# EAGLE board Front_Unit_5.4 (EAGLE 9.6.2), part 1 of 4
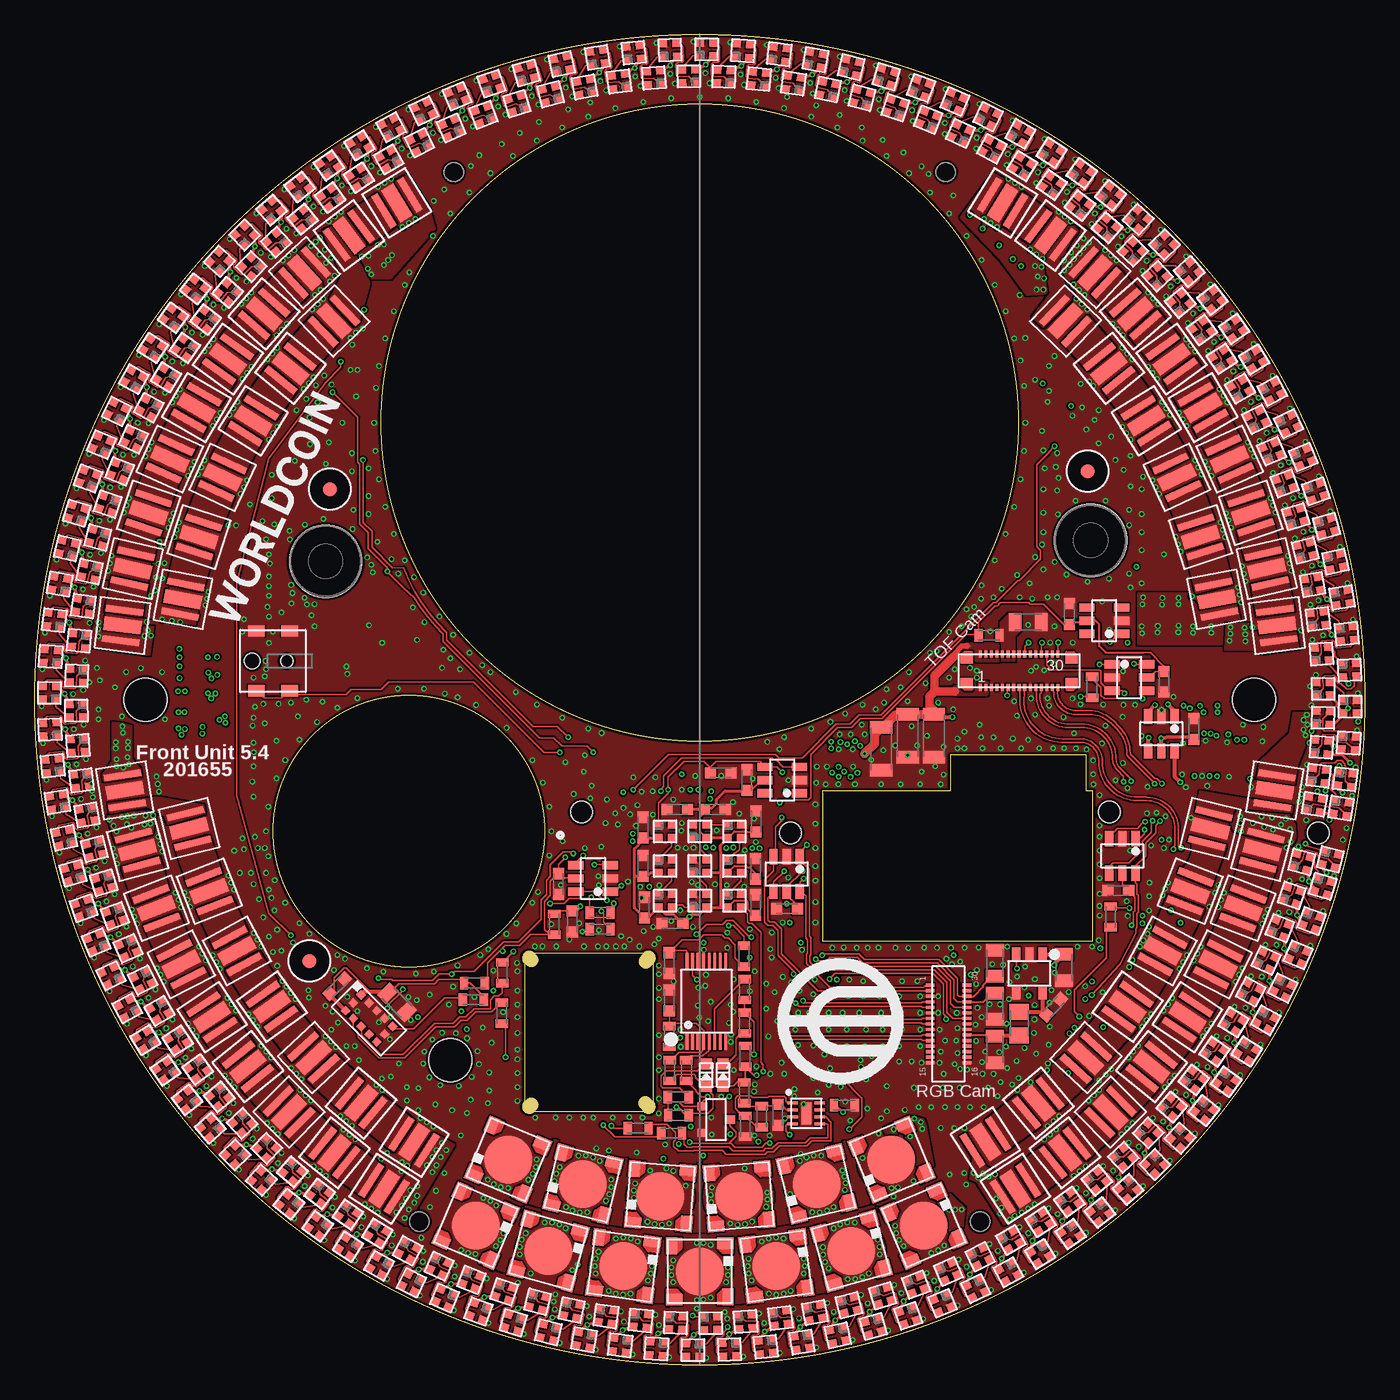
[diagram p9: board, top side]
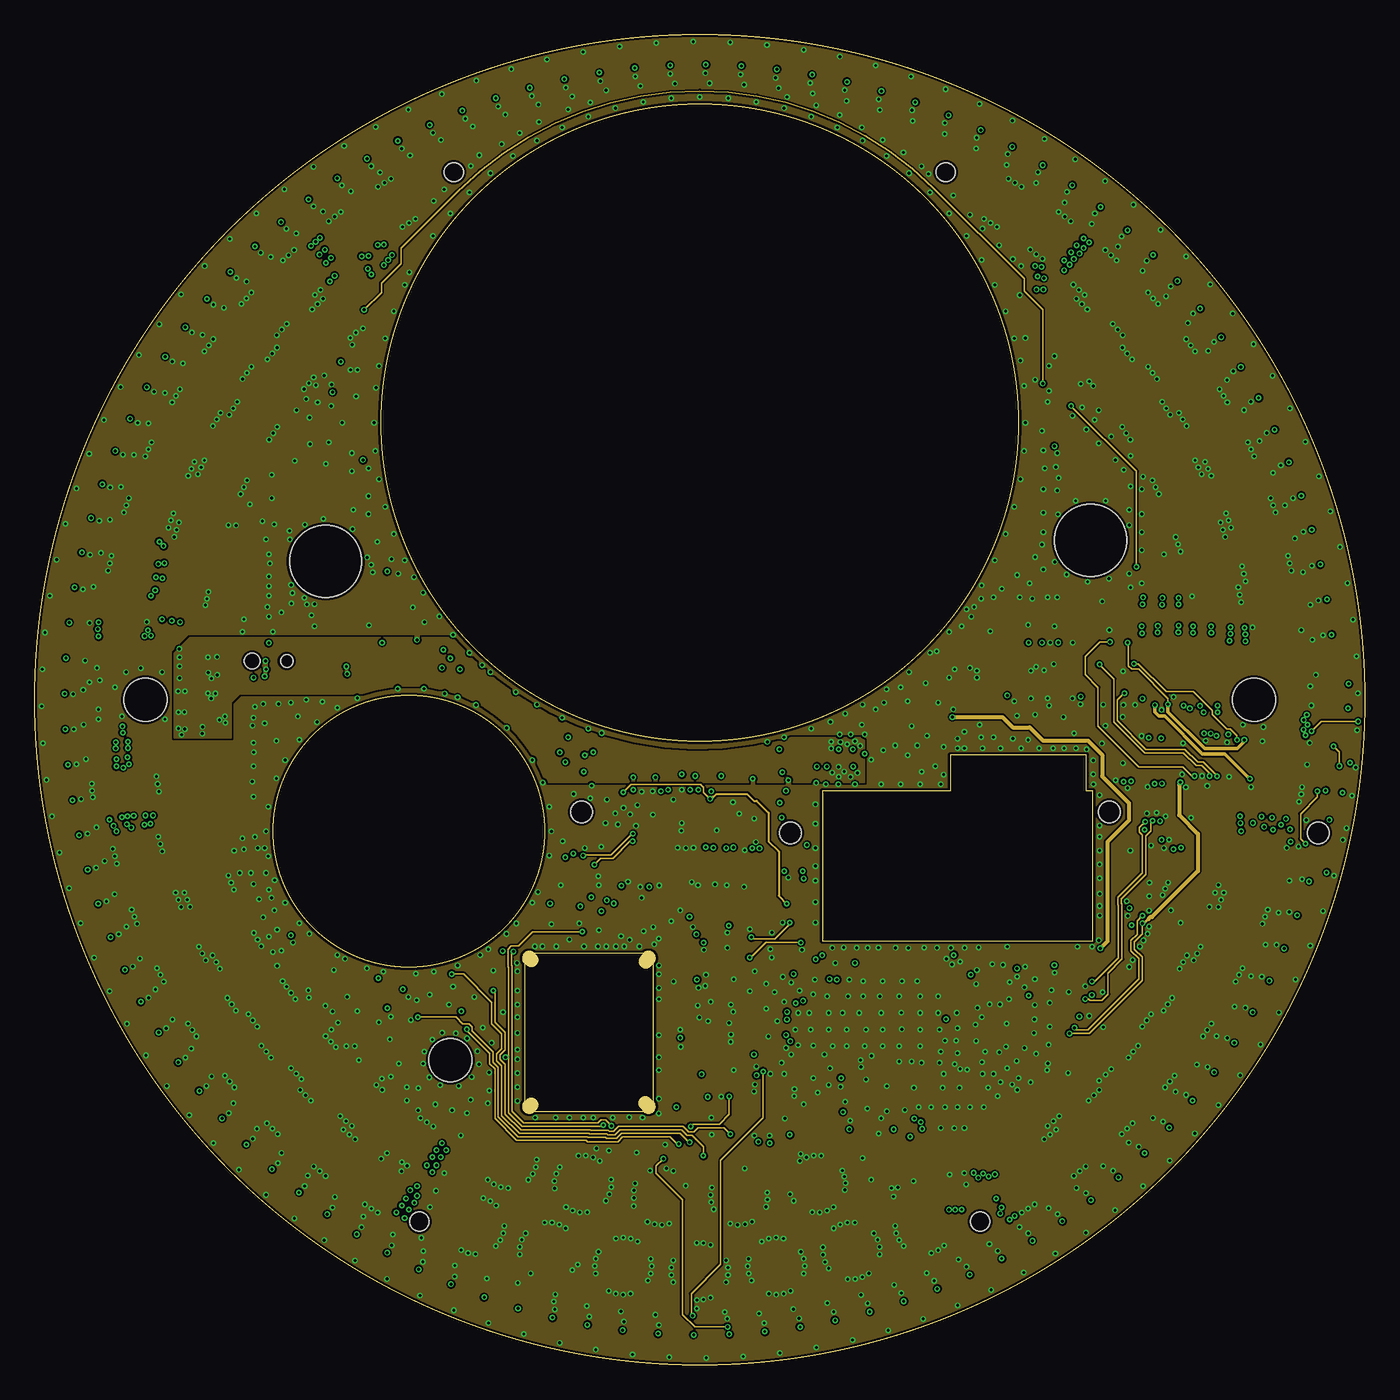
[diagram p10: board, inner layer Route2]
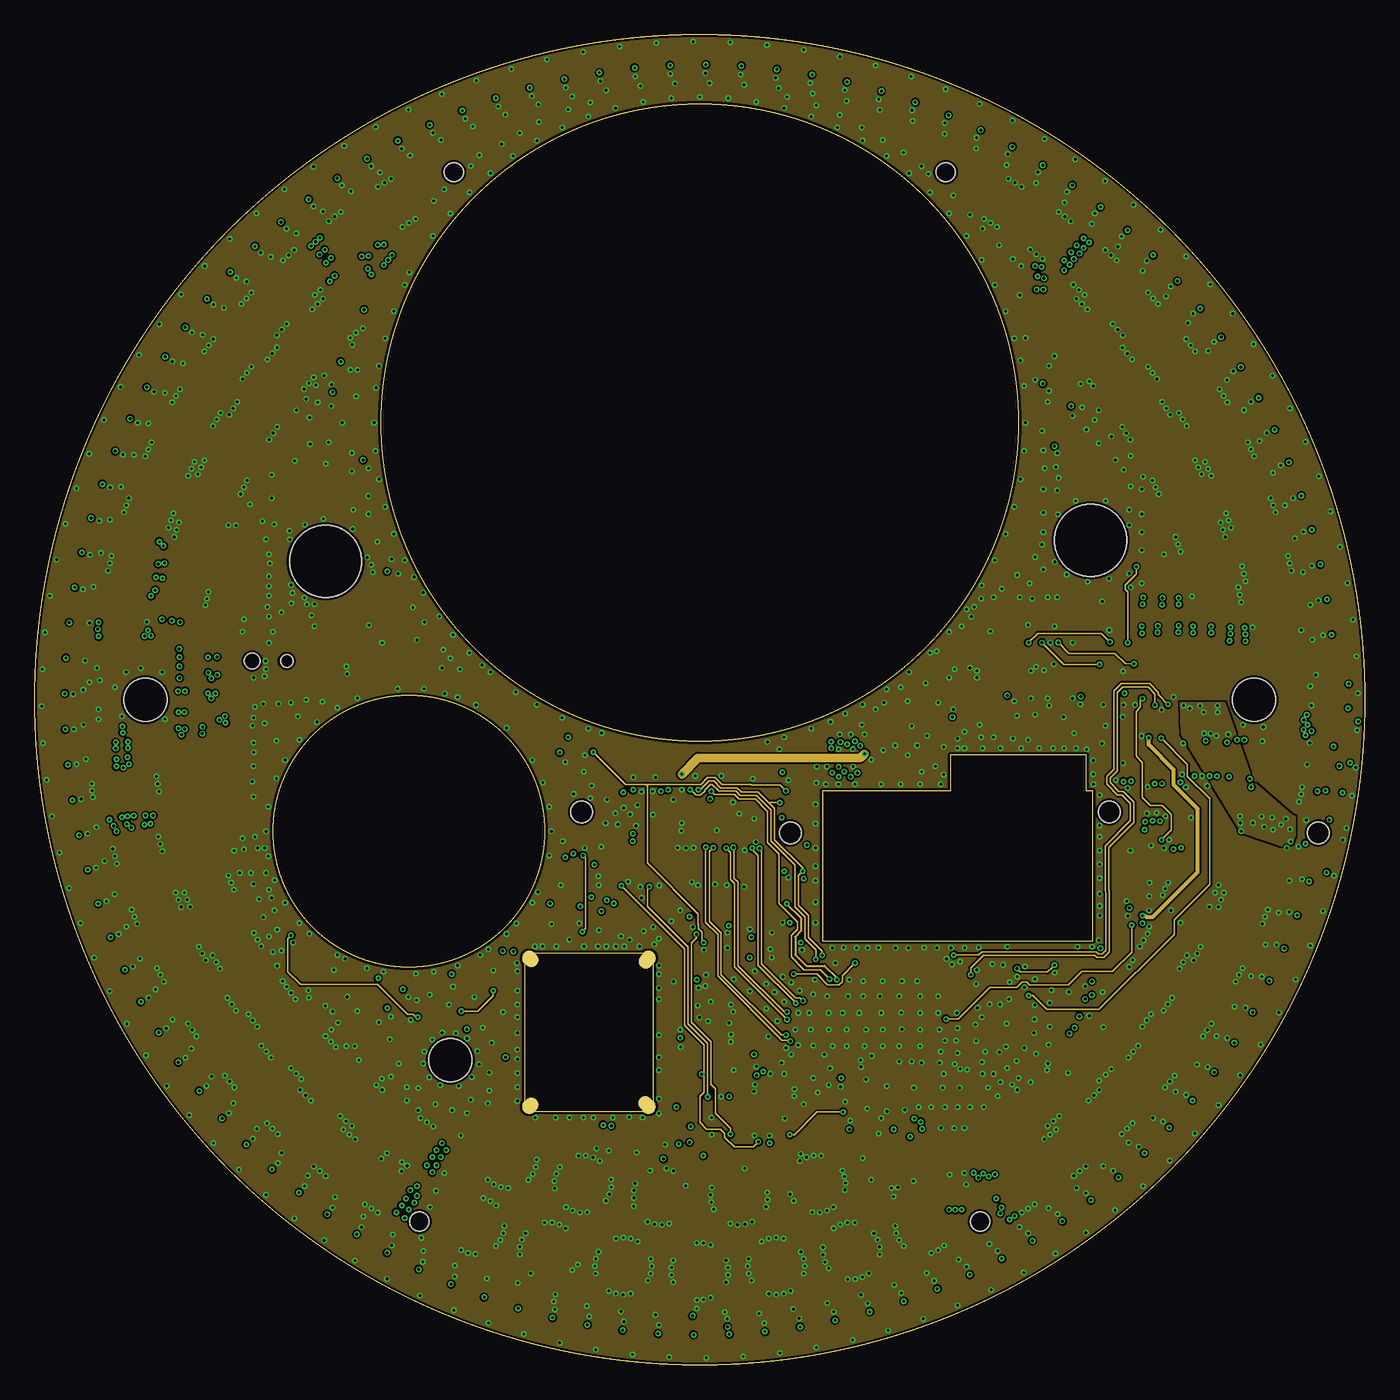
[diagram p11: board, inner layer Route15]
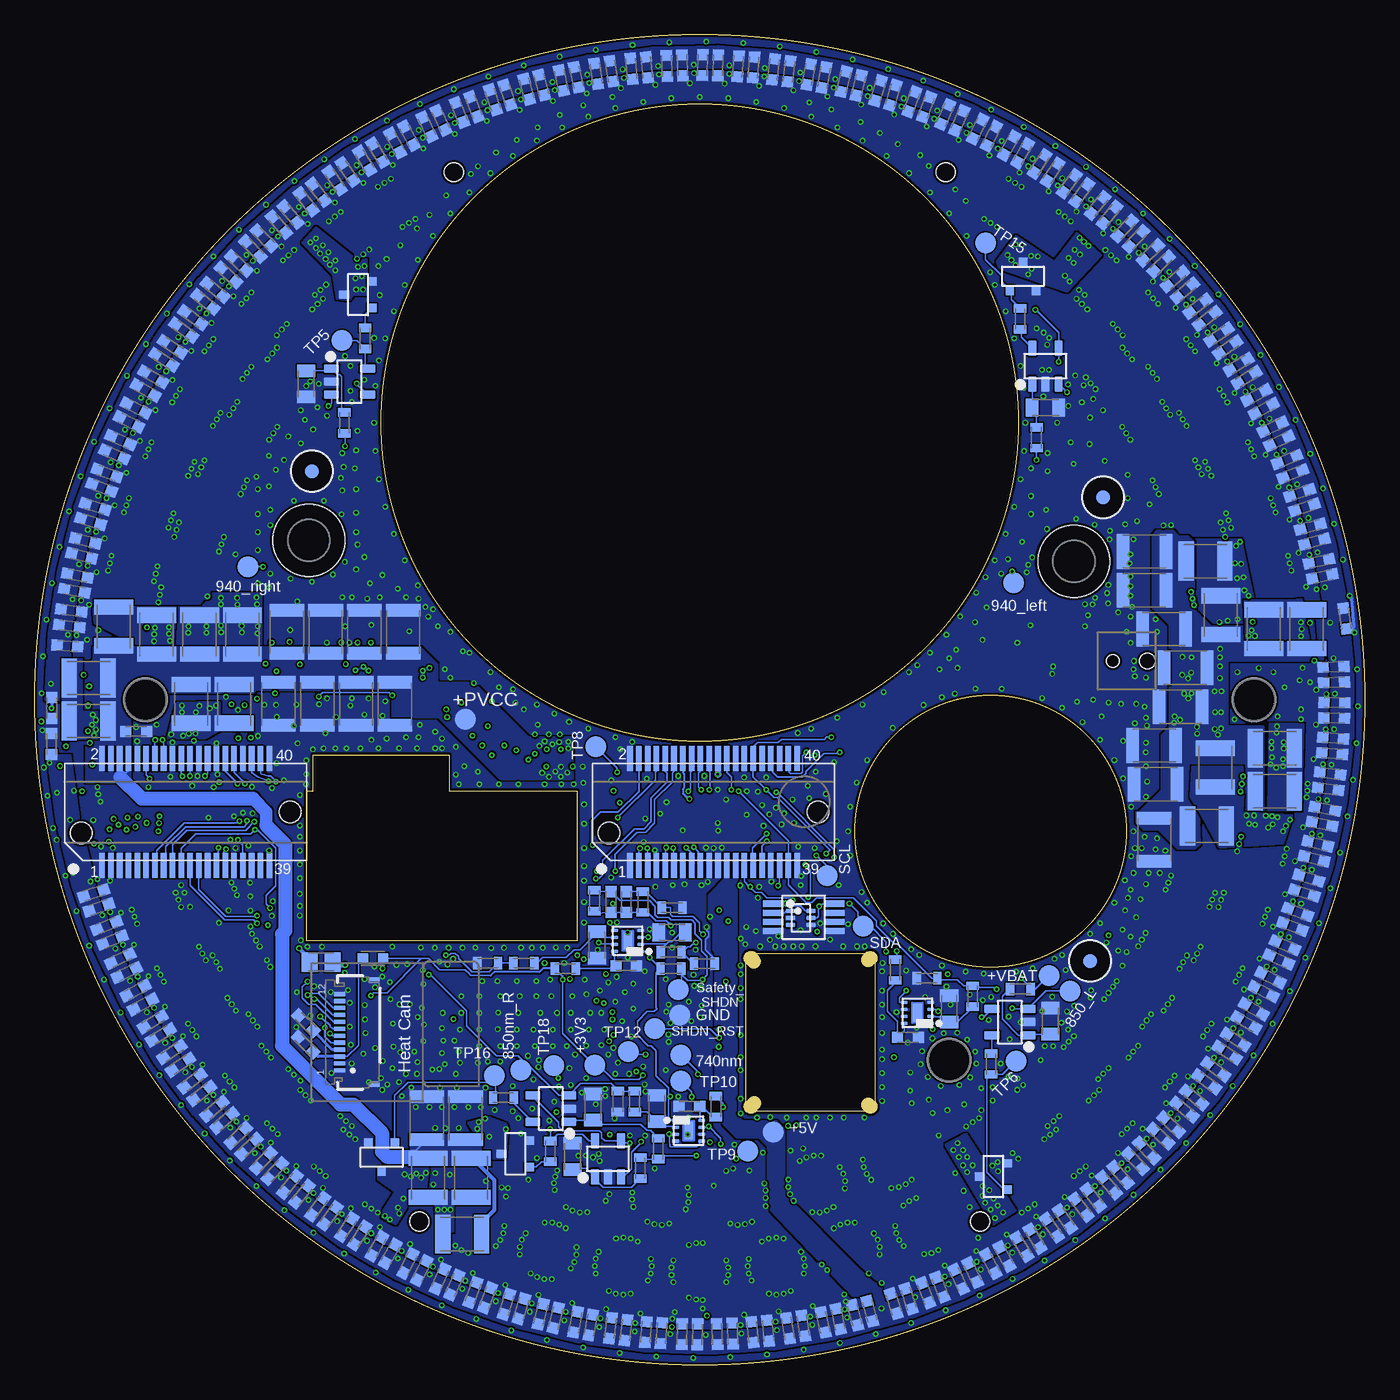
[diagram p12: board, bottom side, seen from below]

Size 96 x 96 mm. Coordinates in mm from the lower left corner, seen from the top.
Outline: 44.65,19 44.65,29 arc180 43.95,29.7 36.05,29.7 arc180 35.35,29 35.35,19 arc180 36.05,18.3 43.95,18.3 arc180 44.65,19
Outline: 75.91,41.4 75.91,44 66.11,44 66.11,41.4 56.85,41.4 56.85,30.6 76.38,30.6 76.38,41.4 75.91,41.4
Outline: circle at 48,68 radius 23
Outline: circle at 27,38.5 radius 9.8
Outline: circle at 48,48 radius 48
Copper layers (1+2*15+16): Top 0.035mm / dielectric 0.14mm / Route2 0.035mm / dielectric 1.2mm / Route15 0.035mm / dielectric 0.14mm / Bottom 0.035mm
Design rules "multi-cb_4L_035um-cu_100um_Strukturen *": minimum track width 0.125mm, minimum drill 0.2mm, track to track 0.125mm, track to pad 0.125mm, pad to pad 0.125mm, via to via 0.125mm, smd to smd 0mil, copper to edge 0.2mm, drill to drill 0.2mm, minimum pad ring 0.1mm, minimum via ring 0.1mm, stop-mask expansion 0.05mm, vias tented up to drill 0.35mm, thermal gap 0.1mm
Net classes: 1 MIPI_diferential_pair: width 0.12 mm, drill 0.2 mm, clearance 0.15 mm to class 0, clearance 0.15 mm
Holes 5.2 mm at 76.2,59.5 21,58
Holes 3.1 mm at 30,22 8,48 88,48
Holes 1.35 mm at 27.77,10.34 68.23,10.34 65.75,86.06 30.25,86.06
tKeepout: area 23.4,43.4 to 72.6,92.6; area 52,19.4 to 60.5,27.9; area 60.5,20.1 to 64,27.1; area 65.3,47.6 to 76.7,52; area 66.5,44 to 75.6,47.6; area 16.2,27.7 to 37.8,49.3; area 27.4,19.4 to 32.5,24.6; 755 lines
bKeepout: area 44.5,20 to 48.5,28; area 48.5,20.1 to 70.5,27.9; area 73.2,56.5 to 79.2,62.5; 1 lines
Milling: 9 lines

## Footprints (pad centres in the part's own frame; a part is rotated, then mirrored left to right if it is on the bottom)
C1210 = smd 0.9 x 2.5: 1 -1.55,0; 2 1.55,0
C0805 = smd 0.9 x 1.3: 1 -0.95,0; 2 0.95,0
C0603 = smd 0.8 x 0.8: 1 -0.75,0; 2 0.75,0
C1206 = smd 0.9 x 1.6: 1 -1.55,0; 2 1.55,0
WL-SMCW_0603_WE = smd 0.8 x 0.8: A -0.8,0; C 0.8,0
LZ1_SMALL_LEDENGIN = smd 0.815 x 1.215: 1 -2.042,1.841; 3 2.042,-1.841 | smd 1.215 x 0.815: 2 1.841,2.042; 4 -1.841,-2.042 | smd 3.45 x 3.45: 5 0,0
B50_LUMINUS = smd 0.5 x 2.7: A -1.1,0; C 1.1,0 | smd 1 x 2.7: NC 0,0
DBV0005A_TI = smd 0.6 x 1.1: 1 -0.95,-1.3; 2 0,-1.3; 3 0.95,-1.3; 4 0.95,1.3; 5 -0.95,1.3
DSG0008A_WSON_TI_NO_VIA = smd 0.5 x 0.25: 1 -0.95,0.75; 2 -0.95,0.25; 3 -0.95,-0.25; 4 -0.95,-0.75; 5 0.95,-0.75; 6 0.95,-0.25; 7 0.95,0.25; 8 0.95,0.75 | smd 0.635 x 1.27: PAD 0,0
VL53L1X_STM = smd 0.5 x 0.5: 1 1.6,-0.8; 2 0.8,-0.8; 3 0,-0.8; 4 -0.8,-0.8; 5 -1.6,-0.8; 6 -1.6,0; 7 -1.6,0.8; 8 -0.8,0.8; 9 0,0.8; 10 0.8,0.8; 11 1.6,0.8; 12 1.6,0
TVSOP-16_TI = smd 0.2 x 1.2: 1 -1.4,-2.9; 2 -1,-2.9; 3 -0.6,-2.9; 4 -0.2,-2.9; 5 0.2,-2.9; 6 0.6,-2.9; 7 1,-2.9; 8 1.4,-2.9; 9 1.4,2.9; 10 1,2.9; 11 0.6,2.9; 12 0.2,2.9; 13 -0.2,2.9; 14 -0.6,2.9; 15 -1,2.9; 16 -1.4,2.9
SOT23-6L_WE = smd 0.6 x 1.1: 1 -0.95,-1.25; 2 0,-1.25; 3 0.95,-1.25; 4 0.95,1.25; 5 0,1.25; 6 -0.95,1.25
S-PDSO-G8_DGK_VSSOP_TI = smd 0.45 x 1.45: 1 -0.975,-2.2; 2 -0.325,-2.2; 3 0.325,-2.2; 4 0.975,-2.2; 5 0.975,2.2; 6 0.325,2.2; 7 -0.325,2.2; 8 -0.975,2.2
DRL0006A_TI = smd 0.67 x 0.3: 1 -0.74,0.5; 2 -0.74,0; 3 -0.74,-0.5; 4 0.74,-0.5; 5 0.74,0; 6 0.74,0.5
WSON008X2120_ROHM = smd 0.22 x 0.75: 1 -0.75,-0.975; 2 -0.25,-0.975; 3 0.25,-0.975; 4 0.75,-0.975; 5 0.75,0.975; 6 0.25,0.975; 7 -0.25,0.975; 8 -0.75,0.975 | smd 1.6 x 0.7: PAD 0,0
R-PDSO-G5_DBV_TI = smd 0.6 x 1.05: 1 -0.95,-1.35; 2 0,-1.35; 3 0.95,-1.35; 4 0.95,1.35; 5 -0.95,1.35
SK6805-EC_IPIXEL = smd 0.55 x 0.55: 1 -0.475,0.475; 2 -0.475,-0.475; 3 0.475,-0.475; 4 0.475,0.475
FERRIT_0603_WIDE_BAND_WUERTH = smd 0.75 x 0.7: 1 -0.725,0; 2 0.725,0
FERRIT_0805_WUERTH = smd 1.15 x 1.42: 1 -0.835,0; 2 0.835,0
PASSERMARKE = smd 1 x 1: P$1 0,0
R0603 = smd 0.6 x 0.9: 1 -0.75,0; 2 0.75,0
R1210 = smd 1.1 x 2.8: 1 -1.4,0; 2 1.4,0
ATE-1C_DIPTRONICS = smd 1.2 x 0.8: 1 -1.2,2.15; 2 1.2,2.15; 3 -1.2,-2.15; 4 1.2,-2.15 | hole 1.1: -1.5,0 | hole 0.9: 1,0
SOT-23_NXP = smd 0.6 x 0.7: 1 0.95,1; 2 -0.95,1; 3 0,-1
TESTPAD_ROUND_1.5MM = smd 1.5 x 1.5: TP 0,0
MEC6-120-02 = smd 0.4 x 1.8: 01 -6.032,-3.85; 02 -6.032,3.85; 03 -5.397,-3.85; 04 -5.397,3.85; 05 -4.763,-3.85; 06 -4.763,3.85; 07 -4.128,-3.85; 08 -4.128,3.85; 09 -3.493,-3.85; 10 -3.493,3.85; 11 -2.857,-3.85; 12 -2.857,3.85; 13 -2.223,-3.85; 14 -2.223,3.85; 15 -1.587,-3.85; 16 -1.587,3.85; 17 -0.953,-3.85; 18 -0.953,3.85; 19 -0.318,-3.85; 20 -0.318,3.85; 21 0.318,-3.85; 22 0.318,3.85; 23 0.953,-3.85; 24 0.953,3.85; 25 1.587,-3.85; 26 1.587,3.85; 27 2.223,-3.85; 28 2.223,3.85; 29 2.857,-3.85; 30 2.857,3.85; 31 3.493,-3.85; 32 3.493,3.85; 33 4.128,-3.85; 34 4.128,3.85; 35 4.763,-3.85; 36 4.763,3.85; 37 5.397,-3.85; 38 5.397,3.85; 39 6.032,-3.85; 40 6.032,3.85 | hole 1.55: -7.537,-1.5; 7.532,0
DF37NC-30DS-0.4V = smd 0.23 x 0.63: 1 -2.8,-1.325; 2 -2.4,-1.325; 3 -2,-1.325; 4 -1.6,-1.325; 5 -1.2,-1.325; 6 -0.8,-1.325; 7 -0.4,-1.325; 8 0,-1.325; 9 0.4,-1.325; 10 0.8,-1.325; 11 1.2,-1.325; 12 1.6,-1.325; 13 2,-1.325; 14 2.4,-1.325; 15 2.8,-1.325; 16 2.8,1.325; 17 2.4,1.325; 18 2,1.325; 19 1.6,1.325; 20 1.2,1.325; 21 0.8,1.325; 22 0.4,1.325; 23 0,1.325; 24 -0.4,1.325; 25 -0.8,1.325; 26 -1.2,1.325; 27 -1.6,1.325; 28 -2,1.325; 29 -2.4,1.325; 30 -2.8,1.325
687112182122_WUERTH = smd 0.3 x 0.8: 1 -2.75,1.4; 2 -2.25,1.4; 3 -1.75,1.4; 4 -1.25,1.4; 5 -0.75,1.4; 6 -0.25,1.4; 7 0.25,1.4; 8 0.75,1.4; 9 1.25,1.4; 10 1.75,1.4; 11 2.25,1.4; 12 2.75,1.4 | smd 0.4 x 0.8: Z1 -3.75,-1.1; Z2 3.75,-1.1
AXE530127_PANASONIC = smd 0.23 x 0.5: 1 -2.8,-1.2; 2 -2.8,1.2; 3 -2.4,-1.2; 4 -2.4,1.2; 5 -2,-1.2; 6 -2,1.2; 7 -1.6,-1.2; 8 -1.6,1.2; 9 -1.2,-1.2; 10 -1.2,1.2; 11 -0.8,-1.2; 12 -0.8,1.2; 13 -0.4,-1.2; 14 -0.4,1.2; 15 0,-1.2; 16 0,1.2; 17 0.4,-1.2; 18 0.4,1.2; 19 0.8,-1.2; 20 0.8,1.2; 21 1.2,-1.2; 22 1.2,1.2; 23 1.6,-1.2; 24 1.6,1.2; 25 2,-1.2; 26 2,1.2; 27 2.4,-1.2; 28 2.4,1.2; 29 2.8,-1.2; 30 2.8,1.2 | smd 0.9 x 0.62: S1 -3.8,0.84; S2 -3.8,-0.84; S3 3.8,-0.84; S4 3.8,0.84

## Placement (x,y rotation side)
C1  4u7 50V  [C1210]  15.9,58.7 180 bottom
C2  4u7 50V  [C1210]  15.9,55.9 180 bottom
C3  1u 25V  [C0805]  23.05,69.08 0 bottom
C4  4u7 50V  [C1210]  15.2,44.7 180 bottom
C5  1u 25V  [C0805]  22.7,24.81 90 bottom
C6  1u 25V  [C0805]  50,31.2 180 bottom
C7  1u 25V  [C0805]  55.4,30.3 270 bottom
C8  1u 25V  [C0805]  30,25.7 90 bottom
C9  1u 25V  [C0805]  51.1,18.5 90 bottom
C10  27p 50V  [C0603]  49.51,42.72 0 top
C11  [C0603]  53.3,33.4 90 bottom  (not fitted)
C12  4u7 50V  [C1210]  13.3,47.5 180 bottom
C13  4u7 50V  [C1210]  14.5,53.1 180 bottom
C14  4u7 50V  [C1210]  12.95,50.3 180 bottom
C15  100p 50V  [C0603]  54.4,33.4 90 bottom
C16  4u7 50V  [C1210]  15.1,41.9 180 bottom
C17  100n 50V  [C0603]  53.3,28.8 0 bottom
C18  100n 50V  [C0603]  32.98,23.63 0 bottom
C19  100n 50V  [C0603]  48.75,18.66 180 bottom
C20  4u7 50V  [C1210]  15.2,37.9 270 bottom
C21  4u7 50V  [C1210]  69.4,52.9 90 bottom
C22  4u7 50V  [C1210]  72.2,52.9 90 bottom
C23  100n 50V  [C0603]  45.8,26.3 90 top
C24  1u 25V  [C0805]  76.4,70.8 270 bottom
C25  4u7 50V  [C1210]  78.4,47.7 270 bottom
C26  1u 25V  [C0805]  55.7,18.6 90 bottom
C27  4u7 50V  [C1210]  75.6,47.7 270 bottom
C28  4u7 50V  [C1210]  75,52.9 90 bottom
C30  4u7 50V  [C1210]  77.8,52.9 90 bottom
C32  4u7 50V  [C1210]  72.8,47.7 270 bottom
C33  4u7 50V  [C1210]  70,47.7 270 bottom
C34  100n 50V  [C0603]  45.8,29 270 top
C37  100n 50V  [C0603]  54.29,32.92 180 top
C38  1u 25V  [C0805]  57.17,15.04 90 bottom
C39  100n 50V  [C0603]  37.8,34.7 270 top
C40  100n 50V  [C0603]  38.8,32 270 top
C41  100n 50V  [C0603]  88.67,45.72 0 bottom
C42  4u7 50V  [C1210]  67.7,17.8 90 bottom
C43  4u7 50V  [C1210]  64.9,17.8 90 bottom
C44  100n 50V  [C0603]  74.67,54.18 90 top
C45  22u 10V  [C0805]  69.3,28.99 90 top
C46  22u 10V  [C0805]  69.3,25.89 270 top
C47  22u 10V  [C0805]  69.3,22.77 270 top
C48  100n 50V  [C0603]  51.4,42.2 90 top
C49  100n 50V  [C0603]  81.5,49.3 270 top
C50  100n 50V  [C0603]  78.2,34.22 180 top
C51  100n 50V  [C0603]  83.65,45.89 90 top
C52  100n 50V  [C0603]  76.43,24.67 135 bottom
C53  100n 50V  [C0603]  76.44,23.12 135 bottom
C54  n.m.  [C1206]  64.9,45.4 270 top  (not fitted)
C55  22u 16V  [C1206]  63,45.4 270 top
C56  22u 16V  [C1206]  61.1,44.45 270 top
C57  100n 50V  [C0603]  21.83,27.32 45 top
C58  4u7 16V  [C0805]  26.16,26.16 315 top
C59  100n 50V  [C0603]  53.63,18.04 270 top
C60  22u 10V  [C0805]  74.28,28.67 270 top
C61  1u 25V  [C0603]  73.54,25.82 48 top
C78  22u 10V  [C0805]  71.7,53.62 0 top
C100  1u 25V  [C0603]  49.28,2.22 89.1 bottom
C101  [C0603]  48.16,2.2 89.1 bottom  (not fitted)
C102  1u 25V  [C0603]  46.75,2.22 92.3 bottom
C103  [C0603]  45.63,2.26 92.3 bottom  (not fitted)
C104  1u 25V  [C0603]  44.18,2.36 95.5 bottom
C105  [C0603]  43.07,2.47 95.5 bottom  (not fitted)
C106  1u 25V  [C0603]  41.63,2.64 98.7 bottom
C107  [C0603]  40.53,2.81 98.7 bottom  (not fitted)
C108  1u 25V  [C0603]  39.1,3.07 101.9 bottom
C109  [C0603]  38,3.3 101.9 bottom  (not fitted)
C110  1u 25V  [C0603]  36.81,3.59 105.1 bottom
C111  [C0603]  35.73,3.88 105.1 bottom  (not fitted)
C112  1u 25V  [C0603]  33.99,4.42 108.3 bottom
C113  [C0603]  32.93,4.77 108.3 bottom  (not fitted)
C114  1u 25V  [C0603]  31.7,5.2 111.6 bottom
C115  [C0603]  30.66,5.61 111.5 bottom  (not fitted)
C116  1u 25V  [C0603]  29.32,6.18 114.8 bottom
C117  [C0603]  28.31,6.65 114.8 bottom  (not fitted)
C118  1u 25V  [C0603]  27.01,7.29 118 bottom
C119  [C0603]  26.02,7.82 118 bottom  (not fitted)
C120  1u 25V  [C0603]  24.76,8.53 121.2 bottom
C121  [C0603]  23.8,9.11 121.2 bottom  (not fitted)
C122  1u 25V  [C0603]  22.58,9.9 124.4 bottom
C123  [C0603]  21.66,10.53 124.4 bottom  (not fitted)
C124  1u 25V  [C0603]  20.49,11.38 127.6 bottom
C125  [C0603]  19.6,12.07 127.6 bottom  (not fitted)
C126  1u 25V  [C0603]  18.48,12.98 130.8 bottom
C127  [C0603]  17.63,13.72 130.8 bottom  (not fitted)
C128  1u 25V  [C0603]  16.56,14.7 134 bottom
C129  [C0603]  15.76,15.47 134.1 bottom  (not fitted)
C130  1u 25V  [C0603]  14.74,16.51 137.3 bottom
C131  [C0603]  13.98,17.33 137.3 bottom  (not fitted)
C132  1u 25V  [C0603]  13.03,18.43 140.5 bottom
C133  [C0603]  12.32,19.29 140.5 bottom  (not fitted)
C134  1u 25V  [C0603]  11.43,20.43 143.7 bottom
C135  [C0603]  10.76,21.33 143.7 bottom  (not fitted)
C136  1u 25V  [C0603]  9.94,22.53 146.9 bottom
C137  [C0603]  9.33,23.46 146.9 bottom  (not fitted)
C138  1u 25V  [C0603]  8.57,24.7 150.1 bottom
C139  [C0603]  8.01,25.67 150.1 bottom  (not fitted)
C140  1u 25V  [C0603]  7.32,26.95 153.3 bottom
C141  [C0603]  6.82,27.95 153.3 bottom  (not fitted)
C142  1u 25V  [C0603]  6.21,29.26 156.5 bottom
C143  [C0603]  5.76,30.29 156.5 bottom  (not fitted)
C144  1u 25V  [C0603]  5.22,31.63 159.8 bottom
C145  [C0603]  4.84,32.68 159.8 bottom  (not fitted)
C146  1u 25V  [C0603]  4.37,34.06 163 bottom
C147  [C0603]  4.05,35.13 163 bottom  (not fitted)
C148  1u 25V  [C0603]  3.66,36.53 166.2 bottom
C149  [C0603]  3.39,37.61 166.2 bottom  (not fitted)
C150  1u 25V  [C0603]  3.09,39.03 169.4 bottom
C151  [C0603]  2.88,40.13 169.4 bottom  (not fitted)
C152  1u 25V  [C0603]  2.65,41.56 172.6 bottom
C153  [C0603]  2.51,42.67 172.6 bottom  (not fitted)
C154  1u 25V  [C0603]  2.37,44.12 175.8 bottom
C155  [C0603]  2.28,45.23 175.8 bottom  (not fitted)
C156  1u 25V  [C0603]  2.22,46.68 179 bottom
C157  [C0603]  2.2,47.8 179 bottom  (not fitted)
C158  1u 25V  [C0603]  2.22,49.25 182.3 bottom
C159  [C0603]  2.26,50.37 182.3 bottom  (not fitted)
C162  1u 25V  [C0603]  1.43,53.85 278 bottom
C164  1u 25V  [C0603]  3.07,56.9 191.9 bottom
C165  [C0603]  3.3,58 191.9 bottom  (not fitted)
C166  1u 25V  [C0603]  3.64,59.41 195.1 bottom
C167  [C0603]  3.94,60.49 195.1 bottom  (not fitted)
C168  1u 25V  [C0603]  4.35,61.88 198.3 bottom
C169  [C0603]  4.7,62.94 198.3 bottom  (not fitted)
C170  1u 25V  [C0603]  5.2,64.3 201.5 bottom
C171  [C0603]  5.61,65.34 201.5 bottom  (not fitted)
C172  1u 25V  [C0603]  6.18,66.68 204.8 bottom
C173  [C0603]  6.65,67.69 204.8 bottom  (not fitted)
C174  1u 25V  [C0603]  7.29,68.99 208 bottom
C175  [C0603]  7.82,69.98 208 bottom  (not fitted)
C176  1u 25V  [C0603]  8.53,71.24 211.2 bottom
C177  [C0603]  9.11,72.2 211.2 bottom  (not fitted)
C178  1u 25V  [C0603]  9.9,73.42 214.4 bottom
C179  [C0603]  10.53,74.34 214.4 bottom  (not fitted)
C180  1u 25V  [C0603]  11.38,75.51 217.6 bottom
C181  [C0603]  12.07,76.4 217.6 bottom  (not fitted)
C182  1u 25V  [C0603]  12.98,77.52 220.8 bottom
C183  [C0603]  13.72,78.37 220.8 bottom  (not fitted)
C184  1u 25V  [C0603]  14.7,79.44 224 bottom
C185  [C0603]  15.47,80.24 224 bottom  (not fitted)
C186  1u 25V  [C0603]  16.51,81.26 227.3 bottom
C187  [C0603]  17.33,82.02 227.3 bottom  (not fitted)
C188  1u 25V  [C0603]  18.43,82.97 230.5 bottom
C189  [C0603]  19.29,83.68 230.5 bottom  (not fitted)
C190  1u 25V  [C0603]  20.43,84.57 233.7 bottom
C191  [C0603]  21.33,85.24 233.7 bottom  (not fitted)
C192  1u 25V  [C0603]  22.53,86.06 236.9 bottom
C193  [C0603]  23.46,86.67 236.9 bottom  (not fitted)
C194  1u 25V  [C0603]  24.7,87.43 240.1 bottom
C195  [C0603]  25.67,87.99 240.1 bottom  (not fitted)
C196  1u 25V  [C0603]  26.95,88.68 243.3 bottom
C197  [C0603]  27.95,89.18 243.3 bottom  (not fitted)
C198  1u 25V  [C0603]  29.26,89.79 246.6 bottom
C199  [C0603]  30.29,90.24 246.5 bottom  (not fitted)
C200  1u 25V  [C0603]  31.63,90.78 249.8 bottom
C201  [C0603]  32.68,91.16 249.8 bottom  (not fitted)
C202  1u 25V  [C0603]  34.06,91.63 253 bottom
C203  [C0603]  35.13,91.95 253 bottom  (not fitted)
C204  1u 25V  [C0603]  36.53,92.34 256.2 bottom
C205  [C0603]  37.61,92.61 256.2 bottom  (not fitted)
C206  1u 25V  [C0603]  39.03,92.91 259.4 bottom
C207  [C0603]  40.13,93.12 259.4 bottom  (not fitted)
C208  1u 25V  [C0603]  41.56,93.35 262.6 bottom
C209  [C0603]  42.67,93.49 262.6 bottom  (not fitted)
C210  1u 25V  [C0603]  44.12,93.64 265.8 bottom
C211  [C0603]  45.23,93.72 265.8 bottom  (not fitted)
C212  1u 25V  [C0603]  46.68,93.78 269 bottom
C213  [C0603]  47.8,93.8 269 bottom  (not fitted)
C214  1u 25V  [C0603]  49.25,93.78 272.3 bottom
C215  [C0603]  50.37,93.74 272.3 bottom  (not fitted)
C216  1u 25V  [C0603]  51.82,93.64 275.5 bottom
C217  [C0603]  52.93,93.53 275.5 bottom  (not fitted)
C218  1u 25V  [C0603]  54.37,93.36 278.7 bottom
C219  [C0603]  55.47,93.19 278.7 bottom  (not fitted)
C220  1u 25V  [C0603]  56.9,92.93 281.9 bottom
C221  [C0603]  58,92.7 281.9 bottom  (not fitted)
C222  1u 25V  [C0603]  59.41,92.36 285.1 bottom
C223  [C0603]  60.49,92.06 285.1 bottom  (not fitted)
C224  1u 25V  [C0603]  61.88,91.65 288.3 bottom
C225  [C0603]  62.94,91.3 288.3 bottom  (not fitted)
C226  1u 25V  [C0603]  64.3,90.8 291.5 bottom
C227  [C0603]  65.34,90.39 291.5 bottom  (not fitted)
C228  1u 25V  [C0603]  66.68,89.82 294.8 bottom
C229  [C0603]  67.69,89.35 294.8 bottom  (not fitted)
C230  1u 25V  [C0603]  68.99,88.71 298 bottom
C231  [C0603]  69.98,88.18 298 bottom  (not fitted)
C232  1u 25V  [C0603]  71.24,87.47 301.2 bottom
C233  [C0603]  72.2,86.89 301.2 bottom  (not fitted)
C234  1u 25V  [C0603]  73.42,86.1 304.4 bottom
C235  [C0603]  74.34,85.47 304.4 bottom  (not fitted)
C236  1u 25V  [C0603]  75.51,84.62 307.6 bottom
C237  [C0603]  76.4,83.93 307.6 bottom  (not fitted)
C238  1u 25V  [C0603]  77.52,83.02 310.8 bottom
C239  [C0603]  78.37,82.28 310.8 bottom  (not fitted)
C240  1u 25V  [C0603]  79.44,81.3 314 bottom
C241  [C0603]  80.24,80.53 314 bottom  (not fitted)
C242  1u 25V  [C0603]  81.26,79.49 317.3 bottom
C243  [C0603]  82.02,78.67 317.3 bottom  (not fitted)
C244  1u 25V  [C0603]  82.97,77.58 320.5 bottom
C245  [C0603]  83.68,76.71 320.5 bottom  (not fitted)
C246  1u 25V  [C0603]  84.57,75.57 323.7 bottom
C247  [C0603]  85.24,74.67 323.7 bottom  (not fitted)
C248  1u 25V  [C0603]  86.06,73.47 326.9 bottom
C249  [C0603]  86.67,72.54 326.9 bottom  (not fitted)
C250  1u 25V  [C0603]  87.43,71.3 330.1 bottom
C251  [C0603]  87.99,70.33 330.1 bottom  (not fitted)
C252  1u 25V  [C0603]  88.68,69.05 333.3 bottom
C253  [C0603]  89.18,68.05 333.3 bottom  (not fitted)
C254  1u 25V  [C0603]  89.79,66.74 336.5 bottom
C255  [C0603]  90.24,65.71 336.5 bottom  (not fitted)
C256  1u 25V  [C0603]  90.78,64.37 339.8 bottom
C257  [C0603]  91.16,63.32 339.8 bottom  (not fitted)
C258  1u 25V  [C0603]  91.63,61.94 343 bottom
C259  [C0603]  91.95,60.87 343 bottom  (not fitted)
C260  1u 25V  [C0603]  92.34,59.47 346.2 bottom
C261  [C0603]  92.61,58.39 346.2 bottom  (not fitted)
C262  1u 25V  [C0603]  92.91,56.97 349.4 bottom
C263  [C0603]  93.12,55.87 349.4 bottom  (not fitted)
C264  1u 25V  [C0603]  93.35,54.44 352.6 bottom
C265  [C0603]  93.49,53.33 352.6 bottom  (not fitted)
C266  1u 25V  [C0603]  93.64,51.88 355.8 bottom
C270  1u 25V  [C0603]  94.77,47.41 270 bottom
C272  1u 25V  [C0603]  94.78,44.81 90 bottom
C280  1u 25V  [C0603]  91.74,34.05 18.3 bottom
C281  [C0603]  91.36,33.01 18.3 bottom  (not fitted)
C282  1u 25V  [C0603]  90.8,31.7 21.5 bottom
C283  [C0603]  90.39,30.66 21.5 bottom  (not fitted)
C284  1u 25V  [C0603]  89.82,29.32 24.8 bottom
C285  [C0603]  89.35,28.31 24.8 bottom  (not fitted)
C286  1u 25V  [C0603]  88.71,27.01 28 bottom
C287  [C0603]  88.18,26.02 28 bottom  (not fitted)
C288  1u 25V  [C0603]  87.47,24.76 31.2 bottom
C289  [C0603]  86.89,23.8 31.2 bottom  (not fitted)
C290  1u 25V  [C0603]  86.1,22.58 34.4 bottom
C291  [C0603]  85.47,21.66 34.4 bottom  (not fitted)
C292  1u 25V  [C0603]  84.62,20.49 37.6 bottom
C293  [C0603]  83.93,19.6 37.6 bottom  (not fitted)
C294  1u 25V  [C0603]  83.02,18.48 40.8 bottom
C295  [C0603]  82.28,17.63 40.8 bottom  (not fitted)
C296  1u 25V  [C0603]  81.3,16.56 44 bottom
C297  [C0603]  80.53,15.76 44 bottom  (not fitted)
C298  1u 25V  [C0603]  79.49,14.74 47.3 bottom
C299  [C0603]  78.67,13.98 47.3 bottom  (not fitted)
C300  1u 25V  [C0603]  77.58,13.03 50.5 bottom
C301  [C0603]  76.71,12.32 50.5 bottom  (not fitted)
C302  1u 25V  [C0603]  75.57,11.43 53.7 bottom
C303  [C0603]  74.67,10.76 53.7 bottom  (not fitted)
C304  1u 25V  [C0603]  73.47,9.94 56.9 bottom
C305  [C0603]  72.54,9.33 56.9 bottom  (not fitted)
C306  1u 25V  [C0603]  71.3,8.57 60.1 bottom
C307  [C0603]  70.33,8.01 60.1 bottom  (not fitted)
C308  1u 25V  [C0603]  69.05,7.32 63.3 bottom
C309  [C0603]  68.05,6.82 63.3 bottom  (not fitted)
C310  1u 25V  [C0603]  66.74,6.21 66.5 bottom
C311  [C0603]  65.71,5.76 66.5 bottom  (not fitted)
C312  1u 25V  [C0603]  64.37,5.22 69.8 bottom
C313  [C0603]  63.32,4.84 69.8 bottom  (not fitted)
C314  1u 25V  [C0603]  61.94,4.37 73 bottom
C315  [C0603]  60.87,4.05 73 bottom  (not fitted)
C316  1u 25V  [C0603]  59.47,3.66 76.2 bottom
C317  [C0603]  58.39,3.39 76.2 bottom  (not fitted)
C318  1u 25V  [C0603]  56.97,3.09 79.4 bottom
C319  [C0603]  55.87,2.88 79.4 bottom  (not fitted)
C320  1u 25V  [C0603]  54.44,2.65 82.6 bottom
C321  [C0603]  53.33,2.51 82.6 bottom  (not fitted)
C322  1u 25V  [C0603]  51.88,2.37 85.8 bottom
C323  [C0603]  50.77,2.28 85.8 bottom  (not fitted)
C324  1u 25V  [C0603]  43.9,38.77 90 top
C325  [C0603]  43.9,36 90 top  (not fitted)
C326  1u 25V  [C0603]  44,33 90 top
C327  [C0603]  46.02,31.85 180 top  (not fitted)
C328  1u 25V  [C0603]  46.38,40.08 180 top
C329  [C0603]  49.09,40.08 0 top  (not fitted)
C330  1u 25V  [C0603]  52.07,39.21 90 top
C331  [C0603]  52.03,35.8 90 top  (not fitted)
C332  1u 25V  [C0603]  52.03,33.18 90 top
D1  150060RS75000  [WL-SMCW_0603_WE]  48.48,20.91 90 top
D2  150060GS75000  [WL-SMCW_0603_WE]  49.69,20.92 90 top
D100  LZ1-00R302  [LZ1_SMALL_LEDENGIN]  34.17,14.82 157.4 top
D101  LZ1-00R302  [LZ1_SMALL_LEDENGIN]  39.56,13.05 166.4 top
D102  LZ1-00R302  [LZ1_SMALL_LEDENGIN]  45.16,12.16 175.5 top
D103  LZ1-00R302  [LZ1_SMALL_LEDENGIN]  50.84,12.16 184.5 top
D104  LZ1-00R302  [LZ1_SMALL_LEDENGIN]  56.44,13.05 193.6 top
D105  LZ1-00R302  [LZ1_SMALL_LEDENGIN]  61.83,14.82 202.6 top
D106  LZ1-00R302  [LZ1_SMALL_LEDENGIN]  64.16,10.05 23.1 top
D107  LZ1-00R302  [LZ1_SMALL_LEDENGIN]  58.94,8.23 15.4 top
D108  LZ1-00R302  [LZ1_SMALL_LEDENGIN]  53.52,7.12 7.7 top
D109  LZ1-00R302  [LZ1_SMALL_LEDENGIN]  48,6.75 0 top
D110  LZ1-00R302  [LZ1_SMALL_LEDENGIN]  42.48,7.12 352.3 top
D111  LZ1-00R302  [LZ1_SMALL_LEDENGIN]  37.06,8.23 344.6 top
D112  LZ1-00R302  [LZ1_SMALL_LEDENGIN]  31.84,10.05 336.9 top
D200  SST-10-IRD-B50-T850  [B50_LUMINUS]  27.39,16.08 327.2 top
D201  SST-10-IRD-B50-T850  [B50_LUMINUS]  23.57,18.9 320 top
D202  SST-10-IRD-B50-T850  [B50_LUMINUS]  20.13,22.17 312.8 top
D203  SST-10-IRD-B50-T850  [B50_LUMINUS]  17.12,25.85 305.7 top
D204  SST-10-IRD-B50-T850  [B50_LUMINUS]  14.6,29.88 298.5 top
D205  SST-10-IRD-B50-T850  [B50_LUMINUS]  12.6,34.19 291.3 top
D206  SST-10-IRD-B50-T850  [B50_LUMINUS]  11.15,38.71 284.2 top
D207  SST-10-IRD-B50-T850  [B50_LUMINUS]  25.22,12.72 327.2 top
D208  SST-10-IRD-B50-T850  [B50_LUMINUS]  21.64,15.3 321.1 top
D209  SST-10-IRD-B50-T850  [B50_LUMINUS]  18.35,18.25 315.1 top
D210  SST-10-IRD-B50-T850  [B50_LUMINUS]  15.39,21.53 309.1 top
D211  SST-10-IRD-B50-T850  [B50_LUMINUS]  12.8,25.09 303.1 top
D212  SST-10-IRD-B50-T850  [B50_LUMINUS]  10.59,28.92 297 top
D213  SST-10-IRD-B50-T850  [B50_LUMINUS]  8.79,32.95 291 top
D214  SST-10-IRD-B50-T850  [B50_LUMINUS]  7.43,37.15 285 top
D215  SST-10-IRD-B50-T850  [B50_LUMINUS]  6.51,41.47 279 top
D250  SST-10-IRD-B50-T850  [B50_LUMINUS]  68.61,16.08 212.8 top
D251  SST-10-IRD-B50-T850  [B50_LUMINUS]  72.43,18.9 220 top
D252  SST-10-IRD-B50-T850  [B50_LUMINUS]  75.87,22.17 227.2 top
D253  SST-10-IRD-B50-T850  [B50_LUMINUS]  78.88,25.85 234.3 top
D254  SST-10-IRD-B50-T850  [B50_LUMINUS]  81.4,29.88 241.5 top
D255  SST-10-IRD-B50-T850  [B50_LUMINUS]  83.4,34.19 248.7 top
D256  SST-10-IRD-B50-T850  [B50_LUMINUS]  84.85,38.71 255.8 top
D257  SST-10-IRD-B50-T850  [B50_LUMINUS]  70.78,12.72 212.8 top
D258  SST-10-IRD-B50-T850  [B50_LUMINUS]  74.36,15.3 218.9 top
D259  SST-10-IRD-B50-T850  [B50_LUMINUS]  77.65,18.25 224.9 top
D260  SST-10-IRD-B50-T850  [B50_LUMINUS]  80.61,21.53 230.9 top
D261  SST-10-IRD-B50-T850  [B50_LUMINUS]  83.2,25.09 236.9 top
D262  SST-10-IRD-B50-T850  [B50_LUMINUS]  85.41,28.92 243 top
D263  SST-10-IRD-B50-T850  [B50_LUMINUS]  87.21,32.95 249 top
D264  SST-10-IRD-B50-T850  [B50_LUMINUS]  88.57,37.15 255 top
D265  SST-10-IRD-B50-T850  [B50_LUMINUS]  89.49,41.47 261 top
D300  SST-10-IRD-B50-S940  [B50_LUMINUS]  21.6,75.33 44 top
D301  SST-10-IRD-B50-S940  [B50_LUMINUS]  18.47,71.91 51 top
D302  SST-10-IRD-B50-S940  [B50_LUMINUS]  15.77,68.14 58 top
D303  SST-10-IRD-B50-S940  [B50_LUMINUS]  13.56,64.06 65 top
D304  SST-10-IRD-B50-S940  [B50_LUMINUS]  11.86,59.74 72 top
D305  SST-10-IRD-B50-S940  [B50_LUMINUS]  10.7,55.25 79 top
D306  SST-10-IRD-B50-S940  [B50_LUMINUS]  26.14,83.86 31.4 top
D307  SST-10-IRD-B50-S940  [B50_LUMINUS]  22.68,81.51 37.1 top
D308  SST-10-IRD-B50-S940  [B50_LUMINUS]  19.48,78.83 42.8 top
D309  SST-10-IRD-B50-S940  [B50_LUMINUS]  16.56,75.85 48.5 top
D310  SST-10-IRD-B50-S940  [B50_LUMINUS]  13.95,72.59 54.2 top
D311  SST-10-IRD-B50-S940  [B50_LUMINUS]  11.67,69.08 59.9 top
D312  SST-10-IRD-B50-S940  [B50_LUMINUS]  9.76,65.37 65.6 top
D313  SST-10-IRD-B50-S940  [B50_LUMINUS]  8.22,61.49 71.3 top
D314  SST-10-IRD-B50-S940  [B50_LUMINUS]  7.08,57.47 77 top
D315  SST-10-IRD-B50-S940  [B50_LUMINUS]  6.34,53.36 82.7 top
D350  SST-10-IRD-B50-S940  [B50_LUMINUS]  74.4,75.33 136 top
D351  SST-10-IRD-B50-S940  [B50_LUMINUS]  77.53,71.91 129 top
D352  SST-10-IRD-B50-S940  [B50_LUMINUS]  80.23,68.14 122 top
D353  SST-10-IRD-B50-S940  [B50_LUMINUS]  82.44,64.06 115 top
D354  SST-10-IRD-B50-S940  [B50_LUMINUS]  84.14,59.74 108 top
D355  SST-10-IRD-B50-S940  [B50_LUMINUS]  85.3,55.25 101 top
D356  SST-10-IRD-B50-S940  [B50_LUMINUS]  69.86,83.86 148.6 top
D357  SST-10-IRD-B50-S940  [B50_LUMINUS]  73.32,81.51 142.9 top
D358  SST-10-IRD-B50-S940  [B50_LUMINUS]  76.52,78.83 137.2 top
D359  SST-10-IRD-B50-S940  [B50_LUMINUS]  79.44,75.85 131.5 top
D360  SST-10-IRD-B50-S940  [B50_LUMINUS]  82.05,72.59 125.8 top
D361  SST-10-IRD-B50-S940  [B50_LUMINUS]  84.33,69.08 120.1 top
D362  SST-10-IRD-B50-S940  [B50_LUMINUS]  86.24,65.37 114.4 top
D363  SST-10-IRD-B50-S940  [B50_LUMINUS]  87.78,61.49 108.7 top
D364  SST-10-IRD-B50-S940  [B50_LUMINUS]  88.92,57.47 103 top
D365  SST-10-IRD-B50-S940  [B50_LUMINUS]  89.66,53.36 97.3 top
IC1  UCC27517DBV  [DBV0005A_TI]  23.05,72.08 0 bottom
IC2  UCC27517DBV  [DBV0005A_TI]  25.61,24.74 90 bottom
IC3  LM393BIDSG  [DSG0008A_WSON_TI_NO_VIA]  53.2,30.6 180 bottom
IC4  LM393BIDSG  [DSG0008A_WSON_TI_NO_VIA]  32.29,25.4 180 bottom
IC5  LM393BIDSG  [DSG0008A_WSON_TI_NO_VIA]  48.8,16.9 0 bottom
IC7  VL53L1CBV0FY/1  [VL53L1X_STM]  24.13,25 135 top
IC8  UCC27517DBV  [DBV0005A_TI]  73.28,70.96 270 bottom
IC9  SN74LVC112ADGV  [TVSOP-16_TI]  48.48,26.24 0 top
IC10  UCC27517DBV  [DBV0005A_TI]  58.75,18.49 90 bottom
IC12  824001  [SOT23-6L_WE]  54.27,35.42 180 top
IC13  UCC27517DBV  [DBV0005A_TI]  54.62,14.86 0 bottom
IC14  824001  [SOT23-6L_WE]  40.3,35.1 90 top
IC15  TMP1075DGK  [S-PDSO-G8_DGK_VSSOP_TI]  40.5,32.3 270 bottom  (not fitted)
IC16  824001  [SOT23-6L_WE]  77.19,53.71 90 top
IC17  824001  [SOT23-6L_WE]  53.95,42.2 90 top
IC18  824001  [SOT23-6L_WE]  79,49.6 270 top
IC19  824001  [SOT23-6L_WE]  78.5,36.73 180 top
IC20  824001  [SOT23-6L_WE]  81.31,45.55 180 top
IC24  TMP112NAIDRL  [DRL0006A_TI]  40.7,32.26 0 bottom
IC25  BU27030NUC  [WSON008X2120_ROHM]  55.69,18.16 270 top
IC31  TLV71328PDBV  [R-PDSO-G5_DBV_TI]  71.79,28.26 180 top
IC100  SK6805-EC15  [SK6805-EC_IPIXEL]  48.79,3.01 1 top
IC101  SK6805-EC15  [SK6805-EC_IPIXEL]  47.51,1.06 269.4 top
IC102  SK6805-EC15  [SK6805-EC_IPIXEL]  46.26,3.03 357.8 top
IC103  SK6805-EC15  [SK6805-EC_IPIXEL]  44.88,1.16 266.2 top
IC104  SK6805-EC15  [SK6805-EC_IPIXEL]  43.74,3.2 354.6 top
IC105  SK6805-EC15  [SK6805-EC_IPIXEL]  42.26,1.41 263 top
IC106  SK6805-EC15  [SK6805-EC_IPIXEL]  41.24,3.51 351.4 top
IC107  SK6805-EC15  [SK6805-EC_IPIXEL]  39.65,1.81 259.8 top
IC108  SK6805-EC15  [SK6805-EC_IPIXEL]  38.75,3.96 348.1 top
IC109  SK6805-EC15  [SK6805-EC_IPIXEL]  37.08,2.35 256.5 top
IC110  SK6805-EC15  [SK6805-EC_IPIXEL]  36.3,4.55 344.9 top
IC111  SK6805-EC15  [SK6805-EC_IPIXEL]  34.53,3.03 253.3 top
IC112  SK6805-EC15  [SK6805-EC_IPIXEL]  33.88,5.27 341.7 top
IC113  SK6805-EC15  [SK6805-EC_IPIXEL]  32.03,3.86 250.1 top
IC114  SK6805-EC15  [SK6805-EC_IPIXEL]  31.51,6.13 338.5 top
IC115  SK6805-EC15  [SK6805-EC_IPIXEL]  29.58,4.82 246.9 top
IC116  SK6805-EC15  [SK6805-EC_IPIXEL]  29.19,7.12 335.3 top
IC117  SK6805-EC15  [SK6805-EC_IPIXEL]  27.19,5.92 243.7 top
IC118  SK6805-EC15  [SK6805-EC_IPIXEL]  26.92,8.24 332.1 top
IC119  SK6805-EC15  [SK6805-EC_IPIXEL]  24.87,7.16 240.5 top
IC120  SK6805-EC15  [SK6805-EC_IPIXEL]  24.73,9.49 328.9 top
IC121  SK6805-EC15  [SK6805-EC_IPIXEL]  22.61,8.52 237.3 top
IC122  SK6805-EC15  [SK6805-EC_IPIXEL]  22.6,10.85 325.6 top
IC123  SK6805-EC15  [SK6805-EC_IPIXEL]  20.44,10 234 top
IC124  SK6805-EC15  [SK6805-EC_IPIXEL]  20.56,12.33 322.4 top
IC125  SK6805-EC15  [SK6805-EC_IPIXEL]  18.35,11.61 230.8 top
IC126  SK6805-EC15  [SK6805-EC_IPIXEL]  18.6,13.93 319.2 top
IC127  SK6805-EC15  [SK6805-EC_IPIXEL]  16.36,13.33 227.6 top
IC128  SK6805-EC15  [SK6805-EC_IPIXEL]  16.74,15.63 316 top
IC129  SK6805-EC15  [SK6805-EC_IPIXEL]  14.46,15.16 224.4 top
IC130  SK6805-EC15  [SK6805-EC_IPIXEL]  14.97,17.43 312.8 top
IC131  SK6805-EC15  [SK6805-EC_IPIXEL]  12.67,17.09 221.2 top
IC132  SK6805-EC15  [SK6805-EC_IPIXEL]  13.31,19.33 309.6 top
IC133  SK6805-EC15  [SK6805-EC_IPIXEL]  11,19.12 218 top
IC134  SK6805-EC15  [SK6805-EC_IPIXEL]  11.76,21.32 306.4 top
IC135  SK6805-EC15  [SK6805-EC_IPIXEL]  9.44,21.24 214.8 top
IC136  SK6805-EC15  [SK6805-EC_IPIXEL]  10.32,23.4 303.1 top
IC137  SK6805-EC15  [SK6805-EC_IPIXEL]  8,23.44 211.5 top
IC138  SK6805-EC15  [SK6805-EC_IPIXEL]  9,25.55 299.9 top
IC139  SK6805-EC15  [SK6805-EC_IPIXEL]  6.68,25.73 208.3 top
IC140  SK6805-EC15  [SK6805-EC_IPIXEL]  7.8,27.77 296.7 top
IC141  SK6805-EC15  [SK6805-EC_IPIXEL]  5.5,28.08 205.1 top
IC142  SK6805-EC15  [SK6805-EC_IPIXEL]  6.73,30.06 293.5 top
IC143  SK6805-EC15  [SK6805-EC_IPIXEL]  4.45,30.49 201.9 top
IC144  SK6805-EC15  [SK6805-EC_IPIXEL]  5.79,32.4 290.3 top
IC145  SK6805-EC15  [SK6805-EC_IPIXEL]  3.53,32.96 198.7 top
IC146  SK6805-EC15  [SK6805-EC_IPIXEL]  4.98,34.79 287.1 top
IC147  SK6805-EC15  [SK6805-EC_IPIXEL]  2.76,35.48 195.5 top
IC148  SK6805-EC15  [SK6805-EC_IPIXEL]  4.31,37.22 283.9 top
IC149  SK6805-EC15  [SK6805-EC_IPIXEL]  2.13,38.03 192.3 top
IC150  SK6805-EC15  [SK6805-EC_IPIXEL]  3.77,39.69 280.6 top
IC151  SK6805-EC15  [SK6805-EC_IPIXEL]  1.64,40.62 189 top
IC152  SK6805-EC15  [SK6805-EC_IPIXEL]  3.38,42.18 277.4 top
IC153  SK6805-EC15  [SK6805-EC_IPIXEL]  1.3,43.23 185.8 top
IC154  SK6805-EC15  [SK6805-EC_IPIXEL]  3.12,44.69 274.2 top
IC155  SK6805-EC15  [SK6805-EC_IPIXEL]  1.11,45.86 182.6 top
IC156  SK6805-EC15  [SK6805-EC_IPIXEL]  3.01,47.21 271 top
IC157  SK6805-EC15  [SK6805-EC_IPIXEL]  1.06,48.49 179.4 top
IC158  SK6805-EC15  [SK6805-EC_IPIXEL]  3.03,49.74 267.8 top
IC159  SK6805-EC15  [SK6805-EC_IPIXEL]  1.16,51.12 176.2 top
IC160  SK6805-EC15  [SK6805-EC_IPIXEL]  3.2,52.26 264.6 top
IC161  SK6805-EC15  [SK6805-EC_IPIXEL]  1.41,53.74 173 top
IC162  SK6805-EC15  [SK6805-EC_IPIXEL]  3.51,54.76 261.4 top
IC163  SK6805-EC15  [SK6805-EC_IPIXEL]  1.81,56.35 169.8 top
IC164  SK6805-EC15  [SK6805-EC_IPIXEL]  3.96,57.25 258.1 top
IC165  SK6805-EC15  [SK6805-EC_IPIXEL]  2.35,58.92 166.5 top
IC166  SK6805-EC15  [SK6805-EC_IPIXEL]  4.55,59.7 254.9 top
IC167  SK6805-EC15  [SK6805-EC_IPIXEL]  3.03,61.47 163.3 top
IC168  SK6805-EC15  [SK6805-EC_IPIXEL]  5.27,62.12 251.7 top
IC169  SK6805-EC15  [SK6805-EC_IPIXEL]  3.86,63.97 160.1 top
IC170  SK6805-EC15  [SK6805-EC_IPIXEL]  6.13,64.49 248.5 top
IC171  SK6805-EC15  [SK6805-EC_IPIXEL]  4.82,66.42 156.9 top
IC172  SK6805-EC15  [SK6805-EC_IPIXEL]  7.12,66.81 245.3 top
IC173  SK6805-EC15  [SK6805-EC_IPIXEL]  5.92,68.81 153.7 top
IC174  SK6805-EC15  [SK6805-EC_IPIXEL]  8.24,69.08 242.1 top
IC175  SK6805-EC15  [SK6805-EC_IPIXEL]  7.16,71.13 150.5 top
IC176  SK6805-EC15  [SK6805-EC_IPIXEL]  9.49,71.27 238.9 top
IC177  SK6805-EC15  [SK6805-EC_IPIXEL]  8.52,73.39 147.3 top
IC178  SK6805-EC15  [SK6805-EC_IPIXEL]  10.85,73.4 235.6 top
IC179  SK6805-EC15  [SK6805-EC_IPIXEL]  10,75.56 144 top
IC180  SK6805-EC15  [SK6805-EC_IPIXEL]  12.33,75.44 232.4 top
IC181  SK6805-EC15  [SK6805-EC_IPIXEL]  11.61,77.65 140.8 top
IC182  SK6805-EC15  [SK6805-EC_IPIXEL]  13.93,77.4 229.2 top
IC183  SK6805-EC15  [SK6805-EC_IPIXEL]  13.33,79.64 137.6 top
IC184  SK6805-EC15  [SK6805-EC_IPIXEL]  15.63,79.26 226 top
IC185  SK6805-EC15  [SK6805-EC_IPIXEL]  15.16,81.54 134.4 top
IC186  SK6805-EC15  [SK6805-EC_IPIXEL]  17.43,81.03 222.8 top
IC187  SK6805-EC15  [SK6805-EC_IPIXEL]  17.09,83.33 131.2 top
IC188  SK6805-EC15  [SK6805-EC_IPIXEL]  19.33,82.69 219.6 top
IC189  SK6805-EC15  [SK6805-EC_IPIXEL]  19.12,85 128 top
IC190  SK6805-EC15  [SK6805-EC_IPIXEL]  21.32,84.24 216.4 top
IC191  SK6805-EC15  [SK6805-EC_IPIXEL]  21.24,86.56 124.8 top
IC192  SK6805-EC15  [SK6805-EC_IPIXEL]  23.4,85.68 213.1 top
IC193  SK6805-EC15  [SK6805-EC_IPIXEL]  23.44,88 121.5 top
IC194  SK6805-EC15  [SK6805-EC_IPIXEL]  25.55,87 209.9 top
IC195  SK6805-EC15  [SK6805-EC_IPIXEL]  25.73,89.32 118.3 top
IC196  SK6805-EC15  [SK6805-EC_IPIXEL]  27.77,88.2 206.7 top
IC197  SK6805-EC15  [SK6805-EC_IPIXEL]  28.08,90.5 115.1 top
IC198  SK6805-EC15  [SK6805-EC_IPIXEL]  30.06,89.27 203.5 top
IC199  SK6805-EC15  [SK6805-EC_IPIXEL]  30.49,91.55 111.9 top
IC200  SK6805-EC15  [SK6805-EC_IPIXEL]  32.4,90.21 200.3 top
IC201  SK6805-EC15  [SK6805-EC_IPIXEL]  32.96,92.47 108.7 top
IC202  SK6805-EC15  [SK6805-EC_IPIXEL]  34.79,91.02 197.1 top
IC203  SK6805-EC15  [SK6805-EC_IPIXEL]  35.48,93.24 105.5 top
IC204  SK6805-EC15  [SK6805-EC_IPIXEL]  37.22,91.69 193.9 top
IC205  SK6805-EC15  [SK6805-EC_IPIXEL]  38.03,93.87 102.3 top
IC206  SK6805-EC15  [SK6805-EC_IPIXEL]  39.69,92.23 190.6 top
IC207  SK6805-EC15  [SK6805-EC_IPIXEL]  40.62,94.36 99 top
IC208  SK6805-EC15  [SK6805-EC_IPIXEL]  42.18,92.62 187.4 top
IC209  SK6805-EC15  [SK6805-EC_IPIXEL]  43.23,94.7 95.8 top
IC210  SK6805-EC15  [SK6805-EC_IPIXEL]  44.69,92.88 184.2 top
IC211  SK6805-EC15  [SK6805-EC_IPIXEL]  45.86,94.89 92.6 top
IC212  SK6805-EC15  [SK6805-EC_IPIXEL]  47.21,92.99 181 top
IC213  SK6805-EC15  [SK6805-EC_IPIXEL]  48.49,94.94 89.4 top
IC214  SK6805-EC15  [SK6805-EC_IPIXEL]  49.74,92.97 177.8 top
IC215  SK6805-EC15  [SK6805-EC_IPIXEL]  51.12,94.84 86.2 top
IC216  SK6805-EC15  [SK6805-EC_IPIXEL]  52.26,92.8 174.6 top
IC217  SK6805-EC15  [SK6805-EC_IPIXEL]  53.74,94.59 83 top
IC218  SK6805-EC15  [SK6805-EC_IPIXEL]  54.76,92.49 171.4 top
IC219  SK6805-EC15  [SK6805-EC_IPIXEL]  56.35,94.19 79.8 top
IC220  SK6805-EC15  [SK6805-EC_IPIXEL]  57.25,92.04 168.1 top
IC221  SK6805-EC15  [SK6805-EC_IPIXEL]  58.92,93.65 76.5 top
IC222  SK6805-EC15  [SK6805-EC_IPIXEL]  59.7,91.45 164.9 top
IC223  SK6805-EC15  [SK6805-EC_IPIXEL]  61.47,92.97 73.3 top
IC224  SK6805-EC15  [SK6805-EC_IPIXEL]  62.12,90.73 161.7 top
IC225  SK6805-EC15  [SK6805-EC_IPIXEL]  63.97,92.14 70.1 top
IC226  SK6805-EC15  [SK6805-EC_IPIXEL]  64.49,89.87 158.5 top
IC227  SK6805-EC15  [SK6805-EC_IPIXEL]  66.42,91.18 66.9 top
IC228  SK6805-EC15  [SK6805-EC_IPIXEL]  66.81,88.88 155.3 top
IC229  SK6805-EC15  [SK6805-EC_IPIXEL]  68.81,90.08 63.7 top
IC230  SK6805-EC15  [SK6805-EC_IPIXEL]  69.08,87.76 152.1 top
IC231  SK6805-EC15  [SK6805-EC_IPIXEL]  71.13,88.84 60.5 top
IC232  SK6805-EC15  [SK6805-EC_IPIXEL]  71.27,86.51 148.9 top
IC233  SK6805-EC15  [SK6805-EC_IPIXEL]  73.39,87.48 57.3 top
IC234  SK6805-EC15  [SK6805-EC_IPIXEL]  73.4,85.15 145.6 top
IC235  SK6805-EC15  [SK6805-EC_IPIXEL]  75.56,86 54 top
IC236  SK6805-EC15  [SK6805-EC_IPIXEL]  75.44,83.67 142.4 top
IC237  SK6805-EC15  [SK6805-EC_IPIXEL]  77.65,84.39 50.8 top
IC238  SK6805-EC15  [SK6805-EC_IPIXEL]  77.4,82.07 139.2 top
IC239  SK6805-EC15  [SK6805-EC_IPIXEL]  79.64,82.67 47.6 top
IC240  SK6805-EC15  [SK6805-EC_IPIXEL]  79.26,80.37 136 top
IC241  SK6805-EC15  [SK6805-EC_IPIXEL]  81.54,80.84 44.4 top
IC242  SK6805-EC15  [SK6805-EC_IPIXEL]  81.03,78.57 132.8 top
IC243  SK6805-EC15  [SK6805-EC_IPIXEL]  83.33,78.91 41.2 top
IC244  SK6805-EC15  [SK6805-EC_IPIXEL]  82.69,76.67 129.6 top
IC245  SK6805-EC15  [SK6805-EC_IPIXEL]  85,76.88 38 top
IC246  SK6805-EC15  [SK6805-EC_IPIXEL]  84.24,74.68 126.4 top
IC247  SK6805-EC15  [SK6805-EC_IPIXEL]  86.56,74.76 34.8 top
IC248  SK6805-EC15  [SK6805-EC_IPIXEL]  85.68,72.6 123.1 top
IC249  SK6805-EC15  [SK6805-EC_IPIXEL]  88,72.56 31.5 top
IC250  SK6805-EC15  [SK6805-EC_IPIXEL]  87,70.45 119.9 top
IC251  SK6805-EC15  [SK6805-EC_IPIXEL]  89.32,70.27 28.3 top
IC252  SK6805-EC15  [SK6805-EC_IPIXEL]  88.2,68.23 116.7 top
IC253  SK6805-EC15  [SK6805-EC_IPIXEL]  90.5,67.92 25.1 top
IC254  SK6805-EC15  [SK6805-EC_IPIXEL]  89.27,65.94 113.5 top
IC255  SK6805-EC15  [SK6805-EC_IPIXEL]  91.55,65.51 21.9 top
IC256  SK6805-EC15  [SK6805-EC_IPIXEL]  90.21,63.6 110.3 top
IC257  SK6805-EC15  [SK6805-EC_IPIXEL]  92.47,63.04 18.7 top
IC258  SK6805-EC15  [SK6805-EC_IPIXEL]  91.02,61.21 107.1 top
IC259  SK6805-EC15  [SK6805-EC_IPIXEL]  93.24,60.52 15.5 top
IC260  SK6805-EC15  [SK6805-EC_IPIXEL]  91.69,58.78 103.9 top
IC261  SK6805-EC15  [SK6805-EC_IPIXEL]  93.87,57.97 12.3 top
IC262  SK6805-EC15  [SK6805-EC_IPIXEL]  92.23,56.31 100.6 top
IC263  SK6805-EC15  [SK6805-EC_IPIXEL]  94.36,55.38 9 top
IC264  SK6805-EC15  [SK6805-EC_IPIXEL]  92.62,53.82 97.4 top
IC265  SK6805-EC15  [SK6805-EC_IPIXEL]  94.7,52.77 5.8 top
IC266  SK6805-EC15  [SK6805-EC_IPIXEL]  92.88,51.31 94.2 top
IC267  SK6805-EC15  [SK6805-EC_IPIXEL]  94.89,50.14 2.6 top
IC268  SK6805-EC15  [SK6805-EC_IPIXEL]  92.99,48.79 91 top
IC269  SK6805-EC15  [SK6805-EC_IPIXEL]  94.94,47.51 359.4 top
IC270  SK6805-EC15  [SK6805-EC_IPIXEL]  92.98,46.7 88.3 top
IC271  SK6805-EC15  [SK6805-EC_IPIXEL]  94.84,44.88 356.2 top
IC272  SK6805-EC15  [SK6805-EC_IPIXEL]  92.87,44.58 85.7 top
IC273  SK6805-EC15  [SK6805-EC_IPIXEL]  94.59,42.26 353 top
IC274  SK6805-EC15  [SK6805-EC_IPIXEL]  92.67,42.52 83 top
IC275  SK6805-EC15  [SK6805-EC_IPIXEL]  94.28,40.18 350.4 top
IC276  SK6805-EC15  [SK6805-EC_IPIXEL]  92.36,40.45 80.3 top
IC277  SK6805-EC15  [SK6805-EC_IPIXEL]  93.5,36.48 345.8 top
IC278  SK6805-EC15  [SK6805-EC_IPIXEL]  91.45,36.3 74.9 top
IC279  SK6805-EC15  [SK6805-EC_IPIXEL]  92.97,34.53 343.3 top
IC280  SK6805-EC15  [SK6805-EC_IPIXEL]  90.73,33.88 71.7 top
IC281  SK6805-EC15  [SK6805-EC_IPIXEL]  92.14,32.03 340.1 top
IC282  SK6805-EC15  [SK6805-EC_IPIXEL]  89.87,31.51 68.5 top
IC283  SK6805-EC15  [SK6805-EC_IPIXEL]  91.18,29.58 336.9 top
IC284  SK6805-EC15  [SK6805-EC_IPIXEL]  88.88,29.19 65.3 top
IC285  SK6805-EC15  [SK6805-EC_IPIXEL]  90.08,27.19 333.7 top
IC286  SK6805-EC15  [SK6805-EC_IPIXEL]  87.76,26.92 62.1 top
IC287  SK6805-EC15  [SK6805-EC_IPIXEL]  88.84,24.87 330.5 top
IC288  SK6805-EC15  [SK6805-EC_IPIXEL]  86.51,24.73 58.9 top
IC289  SK6805-EC15  [SK6805-EC_IPIXEL]  87.48,22.61 327.3 top
IC290  SK6805-EC15  [SK6805-EC_IPIXEL]  85.15,22.6 55.6 top
IC291  SK6805-EC15  [SK6805-EC_IPIXEL]  86,20.44 324 top
IC292  SK6805-EC15  [SK6805-EC_IPIXEL]  83.67,20.56 52.4 top
IC293  SK6805-EC15  [SK6805-EC_IPIXEL]  84.39,18.35 320.8 top
IC294  SK6805-EC15  [SK6805-EC_IPIXEL]  82.07,18.6 49.2 top
IC295  SK6805-EC15  [SK6805-EC_IPIXEL]  82.67,16.36 317.6 top
IC296  SK6805-EC15  [SK6805-EC_IPIXEL]  80.37,16.74 46 top
IC297  SK6805-EC15  [SK6805-EC_IPIXEL]  80.84,14.46 314.4 top
IC298  SK6805-EC15  [SK6805-EC_IPIXEL]  78.57,14.97 42.8 top
IC299  SK6805-EC15  [SK6805-EC_IPIXEL]  78.91,12.67 311.2 top
IC300  SK6805-EC15  [SK6805-EC_IPIXEL]  76.67,13.31 39.6 top
IC301  SK6805-EC15  [SK6805-EC_IPIXEL]  76.88,11 308 top
IC302  SK6805-EC15  [SK6805-EC_IPIXEL]  74.68,11.76 36.4 top
IC303  SK6805-EC15  [SK6805-EC_IPIXEL]  74.76,9.44 304.8 top
IC304  SK6805-EC15  [SK6805-EC_IPIXEL]  72.6,10.32 33.1 top
IC305  SK6805-EC15  [SK6805-EC_IPIXEL]  72.56,8 301.5 top
IC306  SK6805-EC15  [SK6805-EC_IPIXEL]  70.45,9 29.9 top
IC307  SK6805-EC15  [SK6805-EC_IPIXEL]  70.27,6.68 298.3 top
IC308  SK6805-EC15  [SK6805-EC_IPIXEL]  68.23,7.8 26.7 top
IC309  SK6805-EC15  [SK6805-EC_IPIXEL]  67.92,5.5 295.1 top
IC310  SK6805-EC15  [SK6805-EC_IPIXEL]  65.94,6.73 23.5 top
IC311  SK6805-EC15  [SK6805-EC_IPIXEL]  65.51,4.45 291.9 top
IC312  SK6805-EC15  [SK6805-EC_IPIXEL]  63.6,5.79 20.3 top
IC313  SK6805-EC15  [SK6805-EC_IPIXEL]  63.04,3.53 288.7 top
IC314  SK6805-EC15  [SK6805-EC_IPIXEL]  61.21,4.98 17.1 top
IC315  SK6805-EC15  [SK6805-EC_IPIXEL]  60.52,2.76 285.5 top
IC316  SK6805-EC15  [SK6805-EC_IPIXEL]  58.78,4.31 13.9 top
IC317  SK6805-EC15  [SK6805-EC_IPIXEL]  57.97,2.13 282.3 top
IC318  SK6805-EC15  [SK6805-EC_IPIXEL]  56.31,3.77 10.6 top
IC319  SK6805-EC15  [SK6805-EC_IPIXEL]  55.38,1.64 279 top
IC320  SK6805-EC15  [SK6805-EC_IPIXEL]  53.82,3.38 7.4 top
IC321  SK6805-EC15  [SK6805-EC_IPIXEL]  52.77,1.3 275.8 top
IC322  SK6805-EC15  [SK6805-EC_IPIXEL]  51.31,3.12 4.2 top
IC323  SK6805-EC15  [SK6805-EC_IPIXEL]  50.14,1.11 272.6 top
IC324  SK6805-EC15  [SK6805-EC_IPIXEL]  45.5,38.5 0 top
IC325  SK6805-EC15  [SK6805-EC_IPIXEL]  45.5,36 0 top
IC326  SK6805-EC15  [SK6805-EC_IPIXEL]  45.5,33.5 0 top
IC327  SK6805-EC15  [SK6805-EC_IPIXEL]  48,33.5 90 top
IC328  SK6805-EC15  [SK6805-EC_IPIXEL]  48,36 90 top
IC329  SK6805-EC15  [SK6805-EC_IPIXEL]  48,38.5 90 top
IC330  SK6805-EC15  [SK6805-EC_IPIXEL]  50.5,38.5 0 top
IC331  SK6805-EC15  [SK6805-EC_IPIXEL]  50.5,36 0 top
IC332  SK6805-EC15  [SK6805-EC_IPIXEL]  50.5,33.5 0 top
L9  74279269  [FERRIT_0603_WIDE_BAND_WUERTH]  71.58,29.33 180 bottom
L11  742792097  [FERRIT_0805_WUERTH]  75.33,29.07 180 bottom
L14  742792097  [FERRIT_0805_WUERTH]  71.06,24.63 90 top
PS1  PASSERMARKE  [PASSERMARKE]  76,64.5 0 top
PS2  PASSERMARKE  [PASSERMARKE]  21.3,63.2 0 top
PS3  PASSERMARKE  [PASSERMARKE]  19.82,29.15 0 top
PS4  PASSERMARKE  [PASSERMARKE]  19.82,29.15 0 bottom
PS5  PASSERMARKE  [PASSERMARKE]  18.9,62.6 0 bottom
PS6  PASSERMARKE  [PASSERMARKE]  76,64.5 0 bottom
R1  0R  [R0603]  23.7,66.91 90 bottom
R2  10k  [R0603]  31.66,26.36 0 top
R3  56k  [R0603]  47.66,28.95 180 bottom
R4  56k  [R0603]  63.3,29 0 bottom
R5  56k  [R0603]  31.6,27.9 0 bottom
R6  56k  [R0603]  53.9,19 90 bottom
R7  15R 0W75  [R1210]  65.14,9.44 0 bottom
R8  5R49 0W75  [R1210]  11.5,58 180 bottom
R9  0R  [R0603]  24.86,27.13 180 bottom
R10  56k  [R0603]  50.07,29.8 180 bottom
R11  56k  [R0603]  60.7,29 0 bottom
R12  56k  [R0603]  28.3,26.6 270 bottom
R13  56k  [R0603]  52.7,19 270 bottom
R15  5R49 0W75  [R1210]  10.4,54.1 270 bottom
R16  0R  [R0603]  68.88,52.65 180 top
R17  91k  [R0603]  52.1,33.4 270 bottom
R18  27k  [R0603]  50,33 180 bottom
R19  0R  [R0603]  31.75,27.56 180 top
R20  5R49 0W75  [R1210]  6.5,41.4 180 bottom
R21  27R  [R0603]  24.87,75.49 90 bottom
R22  5R49 0W75  [R1210]  6.5,44.5 180 bottom
R23  27R  [R0603]  26.96,21.71 270 bottom
R24  27R  [R0603]  50.08,28.6 0 bottom
R25  5R49 0W75  [R1210]  4.2,53.1 270 bottom
R26  0R  [R0603]  57.7,28.6 180 bottom
R27  0R  [R0603]  33.9,28.5 90 bottom
R28  0R  [R0603]  46.83,18.64 90 bottom
R29  5R49 0W75  [R1210]  7.3,53.1 270 bottom
R30  27R  [R0603]  33.75,28.3 90 top
R31  10k  [R0603]  55.6,33.5 270 bottom
R32  27R  [R0603]  33.71,25.39 270 top
R33  27R  [R0603]  43.55,17.08 180 top
R34  5R49 0W75  [R1210]  10.8,43.1 90 bottom
R35  5R49 0W75  [R1210]  11.4,38.9 180 bottom
R37  27R  [R0603]  45.8,23.7 90 top
R38  0R  [R0603]  73.65,67.98 90 bottom
R39  27R  [R0603]  45.97,16.73 180 top
R40  10k  [R0603]  45.84,21.24 270 top
R43  5R49 0W75  [R1210]  81,52.7 270 bottom
R44  0R  [R0603]  51,15.6 90 bottom
R46  5R49 0W75  [R1210]  84.1,52.7 270 bottom
R47  0R  [R0603]  76.3,48.9 270 top
R49  0R  [R0603]  51.28,17.22 90 top
R52  5R49 0W75  [R1210]  92.1,49.57 0 bottom
R54  27R  [R0603]  72.15,74.08 90 bottom
R55  27R  [R0603]  47.04,21.24 270 top
R56  27R  [R0603]  51.23,27.09 270 top
R57  5R49 0W75  [R1210]  92.1,46.47 0 bottom
R59  27R  [R0603]  62.17,19.28 180 bottom
R60  56k  [R0603]  46.46,18.01 0 top
R62  1k1  [R0603]  46.45,19.34 0 top
R64  56k  [R0603]  51.27,22.27 270 top
R66  5R49 0W75  [R1210]  90.3,53.3 270 bottom
R67  10k  [R0603]  51.23,24.68 270 top
R69  5R49 0W75  [R1210]  87.2,52.7 270 bottom
R70  [R0603]  58.44,18.74 180 top  (not fitted)
R71  [R0603]  52.48,17.92 90 top  (not fitted)
R72  0R  [R0603]  51.2,19.64 270 top
R73  5R49 0W75  [R1210]  84.7,47.7 90 bottom
R75  5R49 0W75  [R1210]  81.6,47.7 90 bottom
R76  0R  [R0603]  51.19,29.5 90 top
R78  0R  [R0603]  52.3,14.2 270 bottom
R79  0R  [R0603]  37.5,31.8 270 top
R80  27R  [R0603]  58.78,15.41 270 bottom
R81  27R  [R0603]  40.81,32.65 180 top
R82  27R  [R0603]  40.81,31.45 180 top
R83  15R 0W75  [R1210]  67.6,13.5 90 bottom
R84  15R 0W75  [R1210]  64.5,13.5 90 bottom
R87  100R  [R0603]  77.65,32.34 90 top
SW1  ATE-1C-V  [ATE-1C_DIPTRONICS]  17.2,50.8 0 top
T2  PMV30ENEA  [SOT-23_NXP]  24.67,78.56 180 bottom
T3  PMV30ENEA  [SOT-23_NXP]  26.81,13.59 270 bottom
T6  PMV30ENEA  [SOT-23_NXP]  72.66,77.24 270 bottom
T7  PMV30ENEA  [SOT-23_NXP]  70.96,14.99 0 bottom
T8  NX7002AK  [SOT-23_NXP]  49.17,17.7 90 top
T10  PMV30ENEA  [SOT-23_NXP]  61.3,15.23 270 bottom
TP1  GND  [TESTPAD_ROUND_1.5MM]  49.44,25.24 0 bottom
TP2  +PVCC  [TESTPAD_ROUND_1.5MM]  64.92,46.59 0 bottom
TP3  [TESTPAD_ROUND_1.5MM]  55.59,21.63 0 bottom
TP4  [TESTPAD_ROUND_1.5MM]  22.8,28.1 0 bottom
TP5  [TESTPAD_ROUND_1.5MM]  73.81,73.92 0 bottom
TP6  [TESTPAD_ROUND_1.5MM]  25.18,21.93 0 bottom
TP7  [TESTPAD_ROUND_1.5MM]  42.7,16.8 0 bottom
TP8  [TESTPAD_ROUND_1.5MM]  55.5,44.6 0 bottom
TP9  [TESTPAD_ROUND_1.5MM]  44.53,15.43 0 bottom
TP10  [TESTPAD_ROUND_1.5MM]  49.36,20.48 0 bottom
TP11  [TESTPAD_ROUND_1.5MM]  49.55,27.09 0 bottom
TP12  [TESTPAD_ROUND_1.5MM]  53.17,22.61 0 bottom
TP13  SAFETY_SHDN_RST  [TESTPAD_ROUND_1.5MM]  51.26,24.26 90 bottom
TP14  [TESTPAD_ROUND_1.5MM]  25.36,56.45 0 bottom
TP15  [TESTPAD_ROUND_1.5MM]  27.37,80.96 0 bottom
TP16  [TESTPAD_ROUND_1.5MM]  62.83,20.89 0 bottom
TP17  [TESTPAD_ROUND_1.5MM]  80.6,57.6 0 bottom
TP18  [TESTPAD_ROUND_1.5MM]  58.55,21.58 0 bottom
TP19  [TESTPAD_ROUND_1.5MM]  49.36,22.36 0 bottom
TP20  [TESTPAD_ROUND_1.5MM]  21.27,26.97 0 bottom
TP21  [TESTPAD_ROUND_1.5MM]  60.92,21.27 0 bottom
TP22  [TESTPAD_ROUND_1.5MM]  38.8,35.3 0 bottom
TP23  [TESTPAD_ROUND_1.5MM]  36.2,31.67 0 bottom
X1  MEC6-120-02-L-DV-A  [MEC6-120-02]  47,39.9 0 bottom
X2  MEC6-120-02-L-DV-A  [MEC6-120-02]  85.1,39.9 0 bottom
X3  DF37NC-30DS-0.4V  [DF37NC-30DS-0.4V]  65.95,24.61 270 top
X4  687112182122  [687112182122_WUERTH]  72.6,24 90 bottom
X5  AXE530127  [AXE530127_PANASONIC]  71.05,50.09 0 top

## Tracks (layer width: path | path; a pad name or v marks a point on that pad's centre or on a via)
!SAFETY_SHDN  (via drill 0.2)
  Top 0.125: v47.8,27.8 47.48,28.11 IC9.15
  Bottom 0.125: R31.1 55.5,34.15 C15.2 53.75,33.5 51.64,33.5 51.24,33.1 51.24,32.47 51.05,32.29 50.26,32.29 50.07,32.1 48.58,32.1 48.35,31.88 48.35,31.1 47.88,30.62 47.88,29.88 47.46,29.46 47.46,28.13 v47.8,27.8 47.84,27.75 48.9,27.75 49.33,28.18 R24.2 49.33,27.32 TP11.TP
$N200
  Top 0.125: IC325.3 45.98,34.92 IC326.1
$N201
  Top 0.125: IC327.3 48.48,34.58 IC328.1
$N202
  Top 0.125: IC329.3 IC330.1
$N203
  Top 0.125: IC331.3 50.98,34.92 IC332.1
+1V2  (via drill 0.2)
  Top 0.125: v56.38,29.27 56.48,29.16 57.17,29.16 57.4,29.39 59.38,29.39 59.77,29 65.15,29 66.35,27.8 66.35,26.45 66.59,26.21 X3.27
  Top 0.15: X3.27 68.46,26.21 69.09,26.84 C46.1
  Route15 0.125: v47.3,41.5 47.35,41.5 47.74,41.11 48.06,41.11 48.36,41.41 48.36,41.47 48.76,41.88 48.9,41.88 49.38,41.4 50.6,41.4 50.91,41.09 52.11,41.09 53.15,40.05 53.15,37.79 54.86,36.08 54.86,33.06 55.59,32.33 55.59,30.74 56.38,29.95 v56.38,29.27
  Bottom 0.125: X1.20 47.32,42.85 47.26,42.79 47.26,41.55 v47.3,41.5
+1V8  (via drill 0.2)
  Top 0.125: C44.1 74.61,53.43 74.28,53.43 72.8,54.91 71.84,54.91 71.74,55.01 69.71,55.01 69.46,54.76 69.29,54.76 68.12,53.6 R16.2 68.08,52.7 67.22,52.7 61.16,46.64 59.59,46.64 58.95,46 57.95,46 56.01,44.06 56.01,40.95 55.83,40.76 54.06,40.76 53.9,40.6 53.8,40.6 v53.77,40.58 | IC18.5 80.25,49.8 80.64,49.8 80.89,50.05 C49.1 81.5,50.41 80.52,51.4 80,51.4 | v55.42,35.62 54.27,34.48 IC12.5 54.27,33.92 55.04,33.16 C37.1 | X3.28 66.7,26.6 66.6,26.7 66.6,27.9 65.25,29.25 59.9,29.25 59.49,29.66 56.93,29.66 v56.83,29.56 | C45.1 69.3,28
  Top 0.15: X3.28 67.78,26.61 68.45,27.28 68.45,27.37 69.08,28 69.3,28 | 80,51.4 77.29,51.4 76.82,51.87 76.82,53.44 76.56,53.7 IC16.5 75.86,53.62 74.86,53.62 C44.1
  Route15 0.125: v47.9,41.5 48.04,41.5 48.66,42.12 49.01,42.12 49.49,41.65 50.7,41.65 51.02,41.34 52.22,41.34 52.98,40.58 | 52.98,40.58 53.4,40.16 53.4,37.9 55.45,35.84 55.45,35.8 55.42,35.77 v55.42,35.62 55.11,35.31 55.11,33.16 55.84,32.44 55.84,30.86 56.83,29.87 v56.83,29.56 | v53.77,40.58 52.98,40.58
  Bottom 0.125: X1.18 47.95,42.85 48.09,42.71 48.09,41.69 v47.9,41.5
+2V8  (via drill 0.2)
  Top 0.125: v57.37,27.85 57.77,28.25 64.84,28.25 65.6,27.49 65.6,25.33 65.77,25.16 v65.77,24.96 | IC19.5 78.5,34.67 C50.1 79.39,33.78 79.39,32.77 79.31,32.68 79.31,31.86 v79.17,31.73
  Route15 0.125: v48.83,41.39 49.06,41.15 50.5,41.15 50.81,40.83 52.01,40.83 52.9,39.94 52.9,37.69 53.71,36.88 53.71,33.28 55.04,31.95 55.04,31.42 54.61,31 54.61,29.43 55.53,28.51 56.71,28.51 v57.37,27.85 | v79.17,31.73 79.17,29.76 77.79,28.39 75.58,28.39 74.61,27.42 71.81,27.42 71.59,27.64 71.27,27.64 70.87,27.23 68.93,27.23 66.65,24.96 v65.77,24.96
  Bottom 0.125: X1.16 48.59,42.85 48.65,42.79 48.65,41.56 v48.83,41.39
+2V8_LDO
  Top 0.15: X3.21 69.22,23.81 C47.1
  Top 0.3: C47.1 69.37,23.79 L14.1
+3V3  (via drill 0.2)
  Top 0.125: v52.1,20.9 51.9,20.9 51.28,21.52 R64.2 | v46.31,18.61 46.42,18.61 47.02,18.01 R60.2 47.36,18.16 48.6,18.16 48.97,18.52 48.97,19.5 48.6,19.87 48.6,20.11 | C39.1 37.78,35.45 37.21,34.88 37.21,33.86 36.81,33.46 36.81,31.44 37.2,31.05 R79.2 35.8,31.05 35.01,30.26 33.96,30.26 33.77,30.07 v33.77,29.86 33.55,29.86 32.7,29.02 32.7,27.76 R19.1 | C39.1 38.11,35.14 39.11,35.14 IC14.5 | C39.1 37.8,36.12 v38.3,36.62 | 48.6,20.11 49.67,20.11 D2.A 50.43,20.12 50.84,20.53 51.27,20.53 | 48.6,20.11 D1.A 48.31,20.11 47.68,20.74 47.68,20.88 47.58,20.98 46.33,20.98 R40.2 | R76.2 51.19,30.93 50.42,31.7 v50.1,31.7
  Top 0.15: R64.2 51.27,20.53 51.27,20.46 R72.1
  Top 0.25: C51.1 83.62,45.14 83.44,45.33 81.69,45.33 81.59,45.22 81.31,45.22
  Top 0.3: IC20.5 81.31,45.22 v81.31,45.23
  Route2 0.125: v48.74,40.84 48.29,41.3 48.29,41.66 48.06,41.89 43.04,41.89 v42.48,41.33
  Route2 0.15: v48.74,40.84 48.89,40.99 48.99,40.99 49.2,41.2 51.4,41.2 51.9,40.7 52.1,40.7 52.97,39.83 52.97,37.77 53.7,37.05 53.7,33.85 v54.27,33.27
  Route15 0.125: v81.31,45.23 83.2,43.34 83.2,42.47 84.8,40.86 84.8,34.67 82.24,32.11 82.24,31.07 76.81,25.64 73.06,25.64 72.06,26.65 v71.74,26.65
  Route15 0.15: v54.27,33.27 55.3,32.25 55.3,31.3 54.9,30.9 54.9,29.6 55.7,28.8 57.01,28.8 57.9,27.91 v57.9,27.8
  Bottom 0.125: C15.1 54.52,32.65 55.6,32.58 R31.2 | C15.1 C11.1 R17.2 51.77,32.65 51.16,32.04 50.39,32.04 50.1,31.75 v50.1,31.7 | v38.3,36.62 38.3,37.2 42.4,41.3 42.5,41.3 v42.48,41.33 | v33.77,29.86 33.77,29.38 R27.2 | v57.9,27.8 57.9,23.94 TP3.TP 55.29,21.63 54.26,20.6 52.4,20.6 v52.1,20.9 | R28.2 46.31,18.87 v46.31,18.61 | C15.1 54.27,32.77 v54.27,33.27 | 64.66,28.24 | 63.08,28.1 64.53,28.1 64.66,28.24 | 64.66,28.24 64.94,28.51 66.76,28.51 67.58,29.33 67.73,29.33 68.1,29.33 | 68.1,29.33 L9.1 | v71.74,26.65 71.53,26.86 70.57,26.86 68.1,29.33
  Bottom 0.15: X1.14 49.22,42.74 49.15,42.67 49.15,41.63 49.23,41.55 49.23,41.22 48.99,40.99 48.89,40.99 v48.74,40.84 | v57.9,27.8 57.9,28.05 R26.2 59.32,28.6 59.57,28.35 62.83,28.35 63.08,28.1
+3V6  (via drill 0.2)
  Top 0.3: C54.1 65.1,46.75 v66.23,46.75